# EAGLE board power-board (EAGLE 6.6.0), part 1 of 3
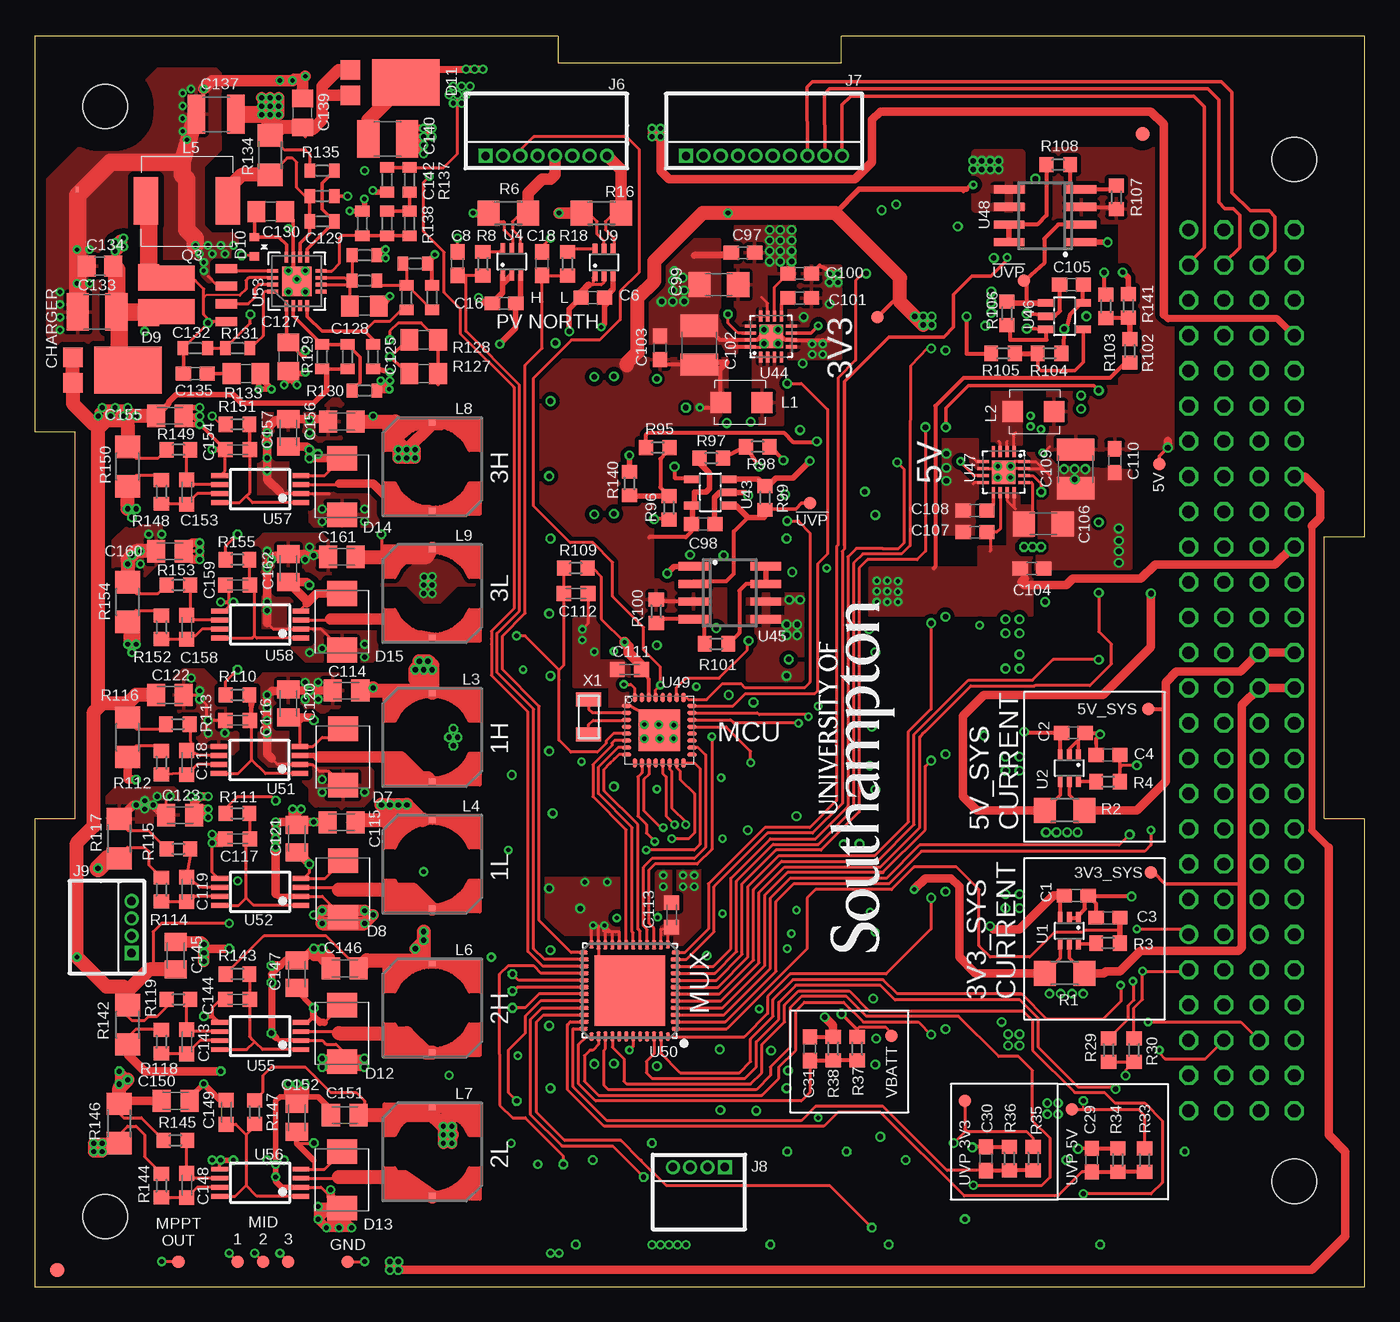
[diagram p18: board, top side]
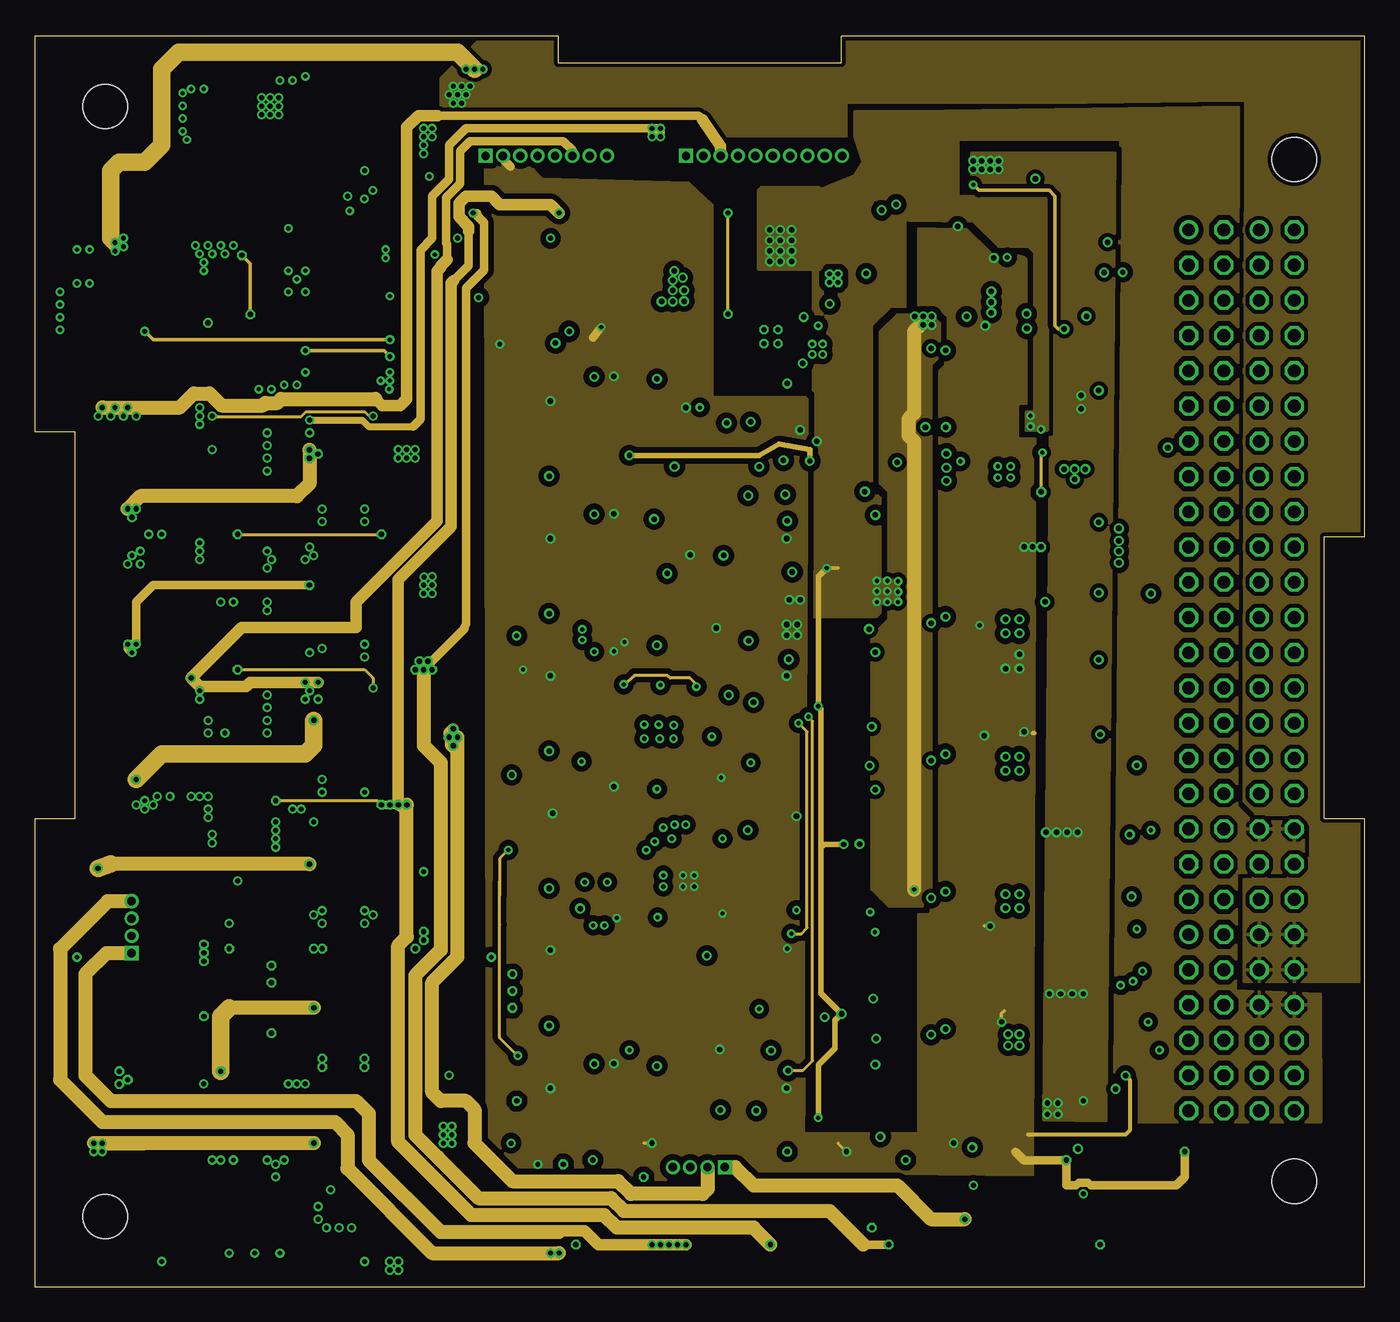
[diagram p19: board, inner layer Route2]
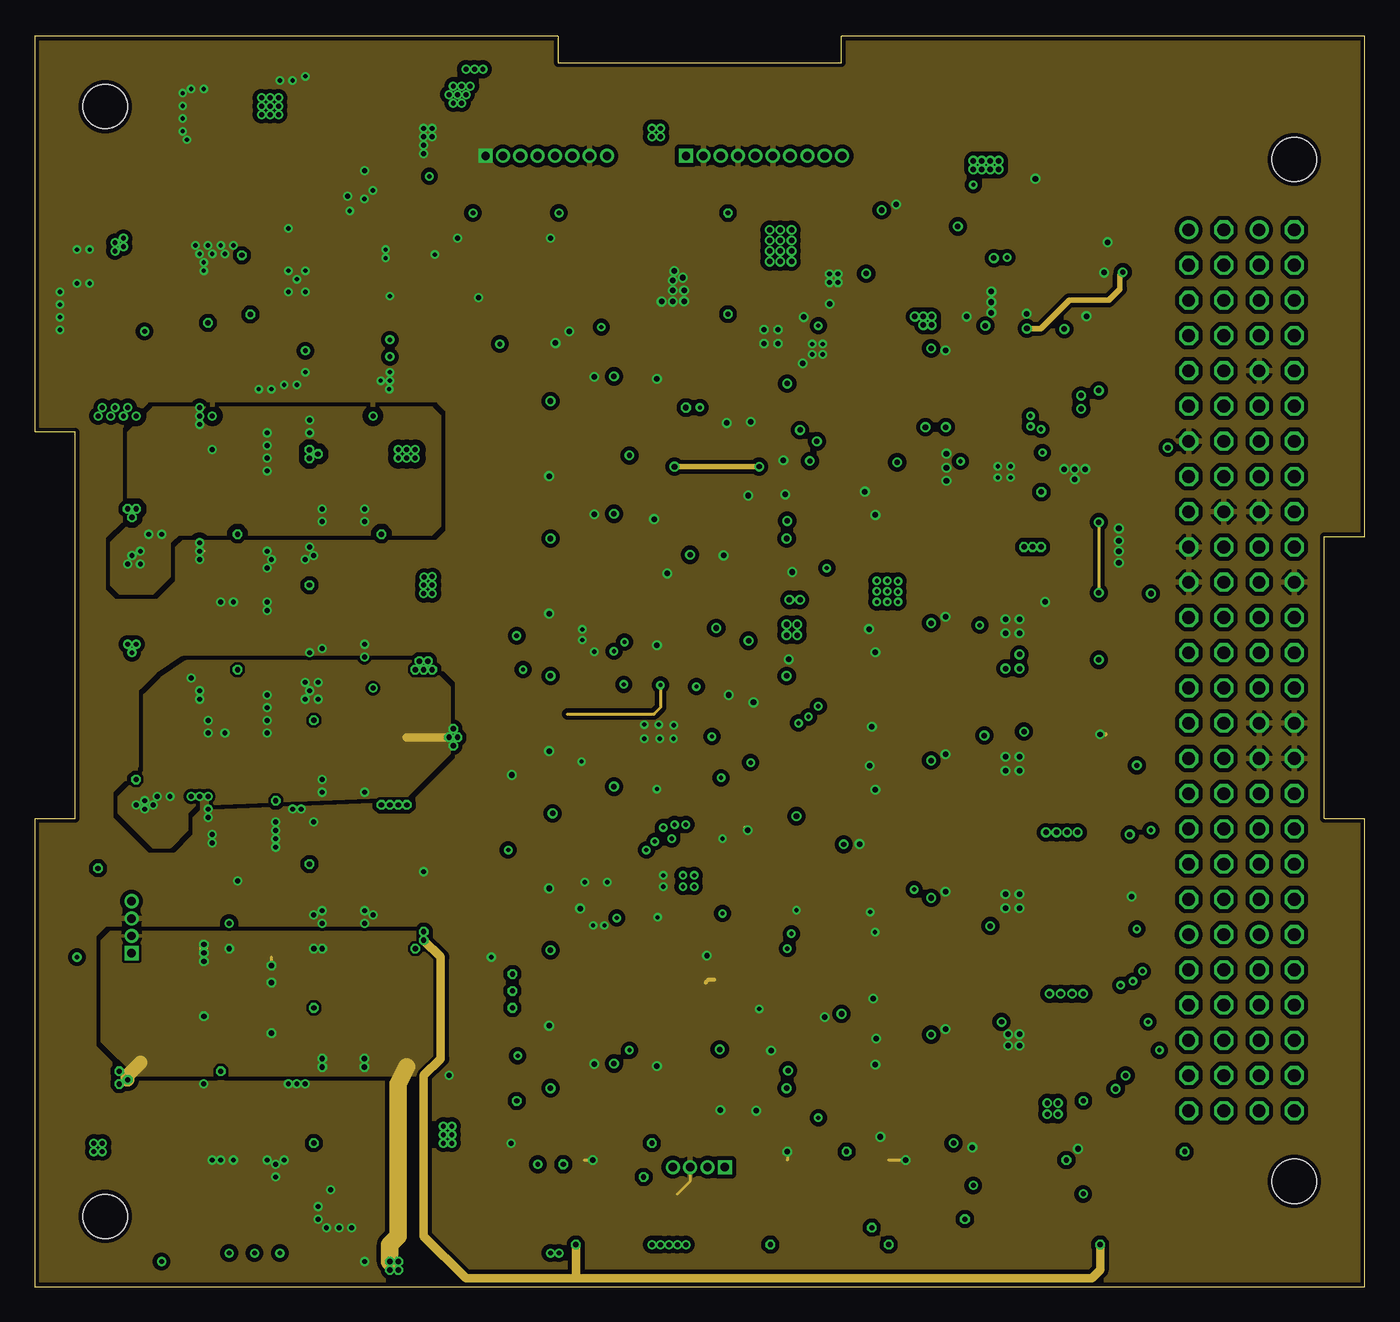
[diagram p20: board, inner layer Route15]
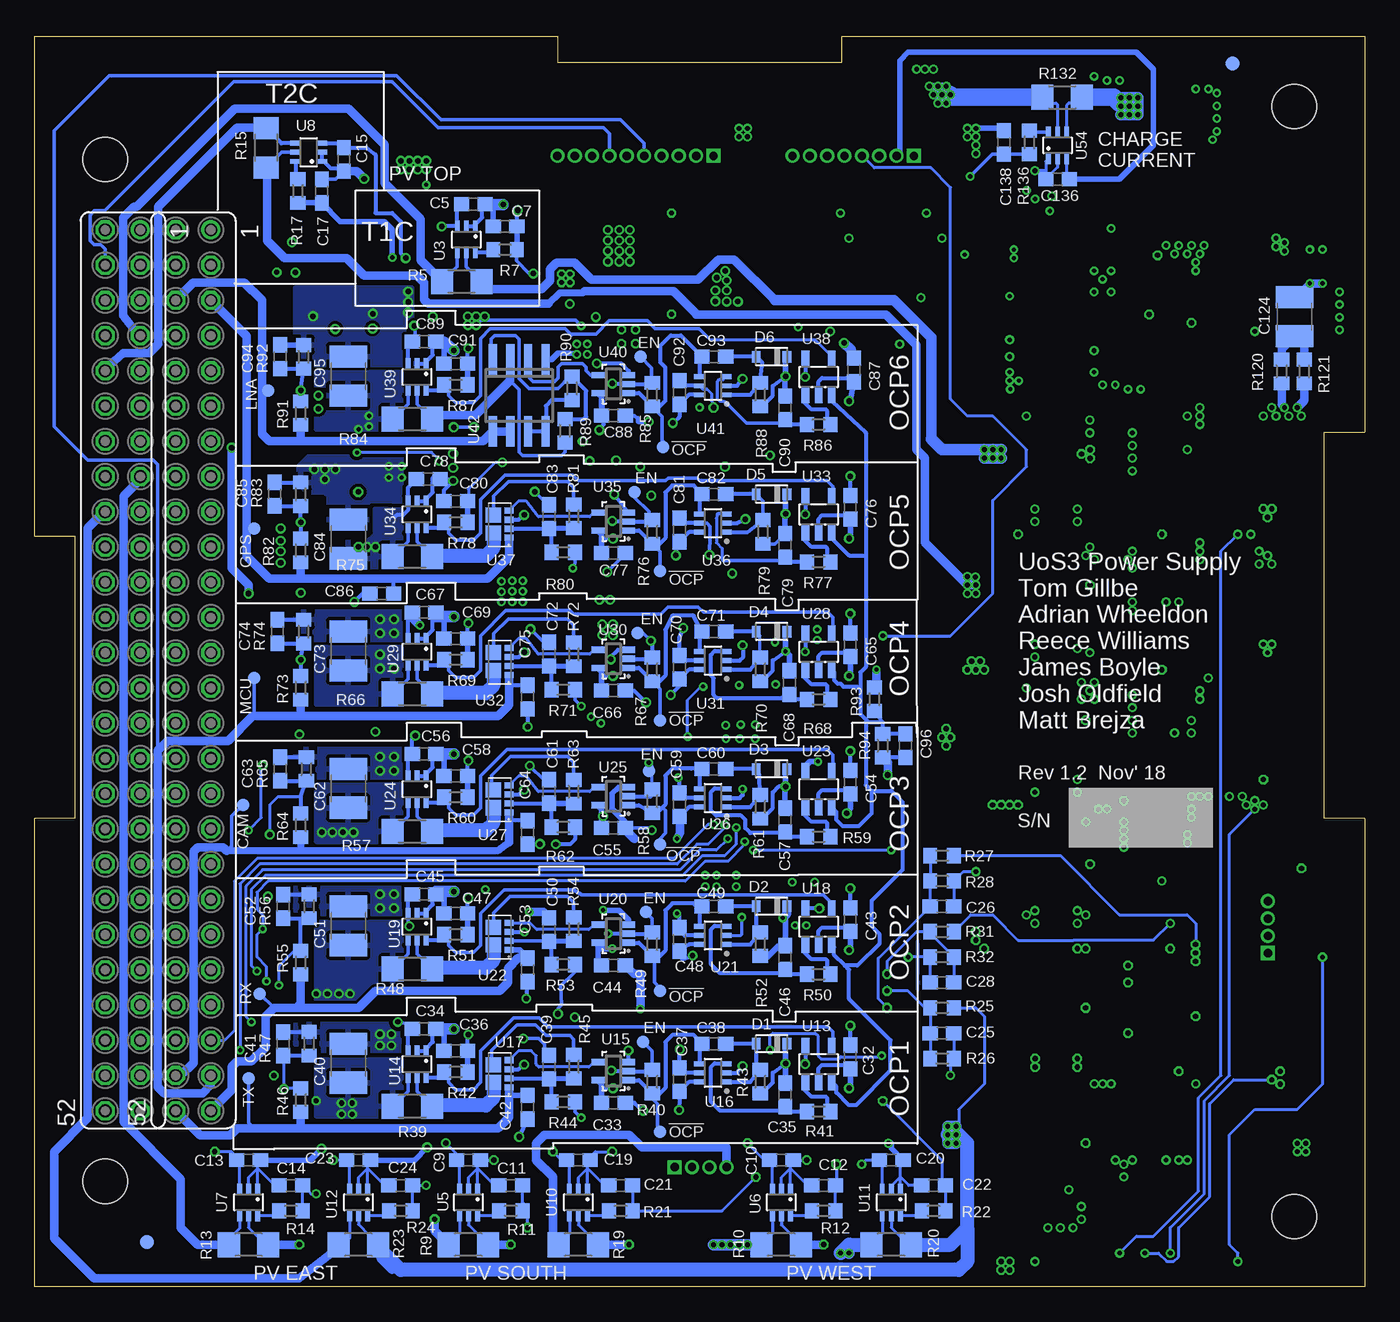
[diagram p21: board, bottom side, seen from below]

Size 95.89 x 90.17 mm. Coordinates in mm from the lower left corner, seen from the top.
Outline: 0,0 95.89,0 95.89,33.78 92.96,33.78 92.96,54.1 95.89,54.1 95.89,90.17 58.17,90.17 58.17,88.27 37.72,88.27 37.72,90.17 0,90.17 0,61.62 2.92,61.62 2.92,33.78 0,33.78 0,0
Copper layers (1*2*15*16): Top 0.035mm / dielectric 0.2mm / Route2 0.035mm / dielectric 1.1mm / Route15 0.035mm / dielectric 0.2mm / Bottom 0.035mm
Design rules "pcbtrain2 *": minimum track width 0.125mm, minimum drill 0.3mm, track to track 8mil, track to pad 6mil, pad to pad 6mil, via to via 7mil, smd to smd 0mil, copper to edge 10mil, drill to drill 0.2mm, minimum pad ring 6mil, minimum via ring 6mil, stop-mask expansion 0.125mm, vias tented up to drill 16mil, thermal gap 10mil
Holes 3.2 mm at 5.08,5.08 5.08,85.09 90.81,7.62 90.81,81.28

## Footprints (pad centres in the part's own frame; a part is rotated, then mirrored left to right if it is on the bottom)
C0603 = smd 1.1 x 1: 1 -0.85,0; 2 0.85,0
C1210 = smd 1.6 x 2.7: 1 -1.4,0; 2 1.4,0
C1206 = smd 1.6 x 1.8: 1 -1.4,0; 2 1.4,0
C0603K = smd 1.05 x 1.08: 1 -0.875,0; 2 0.875,0
C0805K = smd 1.3 x 1.6: 1 -1,0; 2 1,0
P0603 = smd 0.762 x 1.016: 1 -0.889,0; 2 0.889,0
P0805 = smd 1.27 x 1.524: 1 -1.041,0; 2 1.041,0
C0805 = smd 1.3 x 1.5: 1 -0.95,0; 2 0.95,0
P1210 = smd 1.27 x 2.794: 1 -1.422,0; 2 1.422,0
SOD-323 = smd 0.63 x 0.83: 1 -1.113,0; 2 1.113,0
SMBJ = smd 1.78 x 2.16: A 2.04,0; C -2.03,0
POWERDI5 = smd 3.36 x 4.86: HEAT_SINK 0,3.282 | smd 1.39 x 1.4: LEFT -0.92,-0.7; RIGHT 0.92,-0.7
SOD-523 = smd 0.6 x 0.7: 1 -0.7,0; 2 0.7,0
FIDUCIAL-1X2-STOP = smd 1 x 1: 1 0,0
FE26-2 = drill 0.914: 1 -30.48,1.27; 41 20.32,1.27 | drill 0.914 octagon: 2 -30.48,-1.27; 3 -27.94,1.27; 4 -27.94,-1.27; 5 -25.4,1.27; 6 -25.4,-1.27; 7 -22.86,1.27; 8 -22.86,-1.27; 9 -20.32,1.27; 10 -20.32,-1.27; 11 -17.78,1.27; 12 -17.78,-1.27; 13 -15.24,1.27; 14 -15.24,-1.27; 15 -12.7,1.27; 16 -12.7,-1.27; 17 -10.16,1.27; 18 -10.16,-1.27; 19 -7.62,1.27; 20 -7.62,-1.27; 21 -5.08,1.27; 22 -5.08,-1.27; 23 -2.54,1.27; 24 -2.54,-1.27; 25 0,1.27; 26 0,-1.27; 27 2.54,1.27; 28 2.54,-1.27; 29 5.08,1.27; 30 5.08,-1.27; 31 7.62,1.27; 32 7.62,-1.27; 33 10.16,1.27; 34 10.16,-1.27; 35 12.7,1.27; 36 12.7,-1.27; 37 15.24,1.27; 38 15.24,-1.27; 39 17.78,1.27; 40 17.78,-1.27; 42 20.32,-1.27; 43 22.86,1.27; 44 22.86,-1.27; 45 25.4,1.27; 46 25.4,-1.27; 47 27.94,1.27; 48 27.94,-1.27; 49 30.48,1.27; 50 30.48,-1.27; 51 33.02,1.27; 52 33.02,-1.27
DF13-8P-1.25DS = drill 0.6 pad 1.016 square: P$1 4.375,0 | drill 0.6 pad 1.016: P$2 3.125,0; P$3 1.875,0; P$4 0.625,0; P$5 -0.625,0; P$6 -1.875,0; P$7 -3.125,0; P$8 -4.375,0
DF13-10P-1.25DS = drill 0.6 pad 1.016 square: P$1 5.625,0 | drill 0.6 pad 1.016: P$2 4.375,0; P$3 3.125,0; P$4 1.875,0; P$5 0.625,0; P$6 -0.625,0; P$7 -1.875,0; P$8 -3.125,0; P$9 -4.375,0; P$10 -5.625,0
DF13-4P-1.25DS = drill 0.6 pad 1.016 square: P$1 1.875,0 | drill 0.6 pad 1.016: P$2 0.625,0; P$3 -0.625,0; P$4 -1.875,0
VISHAY-INDUCTOR = smd 1.5 x 1.499: 1 -1.508,0; 2 1.476,0
MSS7341 = smd 0.5 x 0.5: 1 0,3.225; 2 0,-3.225
IHLP2525CZ = smd 1.778 x 3.429: 1 -2.946,0; 2 2.946,0
SO8-POWERPAK_DUAL = smd 0.66 x 1.524: 1 -1.905,-2.794; 2 -0.635,-2.794; 3 0.635,-2.794; 4 1.905,-2.794; 5 1.905,2.794; 8 -1.905,2.794 | smd 1.803 x 4.064: PAD56 1.206,1.524; PAD78 -1.206,1.524
R1206 = smd 1.6 x 1.803: 1 -1.422,0; 2 1.422,0
R0603 = smd 1 x 1.1: 1 -0.85,0; 2 0.85,0
SHORT = smd 0.203 x 0.203: 1 -0.076,0; 2 0.076,0
TP09R = smd 0.9 x 0.9: TP 0,0
SC70-6 = smd 0.35 x 0.8: 1 -0.65,-0.95; 2 0,-0.95; 3 0.65,-0.95; 4 0.65,0.95; 5 0,0.95; 6 -0.65,0.95
SOT23-5 = smd 0.55 x 1.2: 1 -0.95,-1.3; 2 0,-1.3; 3 0.95,-1.3; 4 0.95,1.3; 5 -0.95,1.3
SC70-5 = smd 0.45 x 0.95: 1 -0.65,-1.1; 2 0,-1.1; 3 0.65,-1.1; 4 0.65,1.1; 5 -0.65,1.1
CHIPFET-1206A-S2 = smd 0.457 x 0.66: 1 -0.975,-0.68; 2 -0.328,-0.68; 3 0.32,-0.68; 4 0.973,-0.68 | smd 0.55 x 1.12: 5 0.91,0.45; 6 0.37,0.45; 7 -0.367,0.45; 8 -0.9,0.45
SO8 = smd 0.6 x 2.2: 1 -1.905,-2.6; 2 -0.635,-2.6; 3 0.635,-2.6; 4 1.905,-2.6; 5 1.905,2.6; 6 0.635,2.6; 7 -0.635,2.6; 8 -1.905,2.6
RGT.16 = smd 0.8 x 0.23: 1 -1.475,0.75; 2 -1.475,0.25; 3 -1.475,-0.25; 4 -1.475,-0.75; 9 1.475,-0.75; 10 1.475,-0.25; 11 1.475,0.25; 12 1.475,0.75 | smd 0.23 x 0.8: 5 -0.75,-1.475; 6 -0.25,-1.475; 7 0.25,-1.475; 8 0.75,-1.475; 13 0.75,1.475; 14 0.25,1.475; 15 -0.25,1.475; 16 -0.75,1.475 | smd 1.7 x 1.7: PAD 0,0
RHB32 = smd 0.7 x 0.3: 1 -2.35,1.75; 2 -2.35,1.25; 3 -2.35,0.75; 4 -2.35,0.25; 5 -2.35,-0.25; 6 -2.35,-0.75; 7 -2.35,-1.25; 8 -2.35,-1.75; 17 2.35,-1.75; 18 2.35,-1.25; 19 2.35,-0.75; 20 2.35,-0.25; 21 2.35,0.25; 22 2.35,0.75; 23 2.35,1.25; 24 2.35,1.75 | smd 0.3 x 0.7: 9 -1.75,-2.35; 10 -1.25,-2.35; 11 -0.75,-2.35; 12 -0.25,-2.35; 13 0.25,-2.35; 14 0.75,-2.35; 15 1.25,-2.35; 16 1.75,-2.35; 25 1.75,2.35; 26 1.25,2.35; 27 0.75,2.35; 28 0.25,2.35; 29 -0.25,2.35; 30 -0.75,2.35; 31 -1.25,2.35; 32 -1.75,2.35 | smd 3 x 3: TP 0,0
LFCSP48 = smd 0.6 x 0.3: 1 -3.325,2.75; 12 -3.325,-2.75; 25 3.325,-2.75; 36 3.325,2.75 | smd 0.7 x 0.3: 2 -3.3,2.25; 3 -3.3,1.75; 4 -3.3,1.25; 5 -3.3,0.75; 6 -3.3,0.25; 7 -3.3,-0.25; 8 -3.3,-0.75; 9 -3.3,-1.25; 10 -3.3,-1.75; 11 -3.3,-2.25; 26 3.3,-2.25; 27 3.3,-1.75; 28 3.3,-1.25; 29 3.3,-0.75; 30 3.3,-0.25; 31 3.3,0.25; 32 3.3,0.75; 33 3.3,1.25; 34 3.3,1.75; 35 3.3,2.25 | smd 0.3 x 0.6: 13 -2.75,-3.325; 24 2.75,-3.325; 37 2.75,3.325; 48 -2.75,3.325 | smd 0.3 x 0.7: 14 -2.25,-3.3; 15 -1.75,-3.3; 16 -1.25,-3.3; 17 -0.75,-3.3; 18 -0.25,-3.3; 19 0.25,-3.3; 20 0.75,-3.3; 21 1.25,-3.3; 22 1.75,-3.3; 23 2.25,-3.3; 38 2.25,3.3; 39 1.75,3.3; 40 1.25,3.3; 41 0.75,3.3; 42 0.25,3.3; 43 -0.25,3.3; 44 -0.75,3.3; 45 -1.25,3.3; 46 -1.75,3.3; 47 -2.25,3.3 | smd 5.1 x 5.1: EXP 0,0
TSSOP8 = smd 1.2 x 0.35: 1 -2.925,0.975; 2 -2.925,0.325; 3 -2.925,-0.325; 4 -2.925,-0.975; 5 2.925,-0.975; 6 2.925,-0.325; 7 2.925,0.325; 8 2.925,0.975
RVA16_2P14X2P14 = smd 0.787 x 0.279: 1 -1.75,0.75; 2 -1.75,0.25; 3 -1.75,-0.25; 4 -1.75,-0.75; 9 1.75,-0.75; 10 1.75,-0.25; 11 1.75,0.25; 12 1.75,0.75 | smd 0.279 x 0.787: 5 -0.75,-1.75; 6 -0.25,-1.75; 7 0.25,-1.75; 8 0.75,-1.75; 13 0.75,1.75; 14 0.25,1.75; 15 -0.25,1.75; 16 -0.75,1.75 | smd 2.134 x 2.134: 17 0,0
CC7V-T1A = smd 1.8 x 1: P$1 0,1.25; P$2 0,-1.25

## Placement (x,y rotation side)
C1  100n  [C0603]  75.08,28.21 0 top
C2  100n  [C0603]  74.88,39.94 0 top
C3  1u  [C0603]  77.37,26.62 180 top
C4  1u  [C0603]  77.37,38.35 180 top
C5  100n  [C0603]  64.26,78.04 0 bottom
C6  100n  [C0603]  40.23,71.32 180 top
C7  1u  [C0603]  61.98,76.45 180 bottom
C8  1u  [C0603]  30.48,73.76 90 top
C9  100n  [C0603]  64.62,9.14 0 bottom
C10  100n  [C0603]  42.06,9.14 0 bottom
C11  1u  [C0603]  61.57,7.32 180 bottom
C12  1u  [C0603]  39.01,7.32 180 bottom
C13  100n  [C0603]  80.47,9.14 0 bottom
C14  1u  [C0603]  77.42,7.32 180 bottom
C15  100n  [C0603]  73.6,81.28 270 bottom
C16  100n  [C0603]  33.83,70.9 180 top
C17  1u  [C0603]  75.18,78.99 90 bottom
C18  1u  [C0603]  36.58,73.76 90 top
C19  100n  [C0603]  56.69,9.14 0 bottom
C20  100n  [C0603]  34.14,9.14 0 bottom
C21  1u  [C0603]  53.64,7.32 180 bottom
C22  1u  [C0603]  31.09,7.32 180 bottom
C23  100n  [C0603]  72.54,9.14 0 bottom
C24  1u  [C0603]  69.49,7.32 180 bottom
C25  1u  [C0603]  30.48,18.29 0 bottom
C26  1u  [C0603]  30.48,27.43 0 bottom
C28  1u  [C0603]  30.48,21.95 180 bottom
C29  1u  [C0603]  76.2,9.14 90 top
C30  1u  [C0603]  68.58,9.25 90 top
C31  1u  [C0603]  55.88,17.17 90 top
C32  100n  [C0603]  37.08,16.57 90 bottom
C33  100n  [C0603]  54.17,13.27 0 bottom
C34  100n  [C0603]  67.82,18.61 0 bottom
C35  1n  [C0603]  41.78,13.84 90 bottom
C36  1u  [C0603]  65.53,17.02 180 bottom
C37  100n  [C0603]  49.4,14.95 270 bottom
C38  1u  [C0603]  46.93,17.53 180 bottom
C39  1n  [C0603]  58.8,15.85 90 bottom
C40  22u  [C1210]  73.28,16.13 90 bottom
C41  100n  [C0603]  77.98,17.53 90 bottom
C42  510p  [C0603]  60.35,12.95 270 bottom
C43  100n  [C0603]  37.08,26.48 90 bottom
C44  100n  [C0603]  54.17,23.18 0 bottom
C45  100n  [C0603]  67.82,28.31 0 bottom
C46  1n  [C0603]  41.78,23.75 90 bottom
C47  1u  [C0603]  65.53,26.92 180 bottom
C48  100n  [C0603]  49.4,25.06 270 bottom
C49  1u  [C0603]  46.93,27.43 180 bottom
C50  1n  [C0603]  58.8,25.76 90 bottom
C51  22u  [C1210]  73.28,26.04 90 bottom
C52  100n  [C0603]  77.98,27.43 90 bottom
C53  510p  [C0603]  60.35,22.86 270 bottom
C54  100n  [C0603]  37.08,36.39 90 bottom
C55  100n  [C0603]  54.17,33.08 0 bottom
C56  100n  [C0603]  67.82,38.42 0 bottom
C57  1n  [C0603]  41.78,33.66 90 bottom
C58  1u  [C0603]  65.53,36.83 180 bottom
C59  100n  [C0603]  49.4,34.76 270 bottom
C60  1u  [C0603]  46.93,37.34 180 bottom
C61  1n  [C0603]  58.8,35.71 90 bottom
C62  22u  [C1210]  73.28,35.94 90 bottom
C63  100n  [C0603]  78.18,37.34 90 bottom
C64  510p  [C0603]  60.35,32.77 270 bottom
C65  100n  [C0603]  37.08,46.29 90 bottom
C66  100n  [C0603]  54.17,42.99 0 bottom
C67  100n  [C0603]  67.82,48.63 0 bottom
C68  1n  [C0603]  41.48,43.56 90 bottom
C69  1u  [C0603]  65.53,46.74 180 bottom
C70  100n  [C0603]  49.4,44.67 270 bottom
C71  1u  [C0603]  46.93,47.24 180 bottom
C72  1n  [C0603]  58.8,45.62 90 bottom
C73  22u  [C1210]  73.28,45.85 90 bottom
C74  100n  [C0603]  78.38,47.24 90 bottom
C75  510p  [C0603]  60.35,42.52 270 bottom
C76  100n  [C0603]  37.08,56.2 90 bottom
C77  100n  [C0603]  54.17,52.9 0 bottom
C78  100n  [C0603]  67.51,58.23 0 bottom
C79  470n  [C0603]  41.78,53.47 90 bottom
C80  1u  [C0603]  65.53,56.64 180 bottom
C81  100n  [C0603]  49.4,54.57 270 bottom
C82  1u  [C0603]  46.93,57.15 180 bottom
C83  1n  [C0603]  58.8,55.52 90 bottom
C84  22u  [C1210]  73.28,53.92 90 bottom
C85  100n  [C0603]  78.59,57.15 90 bottom
C86  510p  [C0603]  70.87,49.99 180 bottom
C87  100n  [C0603]  36.83,66.1 90 bottom
C88  100n  [C0603]  54.17,62.8 0 bottom
C89  100n  [C0603]  67.82,68.14 0 bottom
C90  1n  [C0603]  41.78,63.37 90 bottom
C91  1u  [C0603]  65.53,66.55 180 bottom
C92  100n  [C0603]  49.4,64.48 270 bottom
C93  1u  [C0603]  46.93,67.06 180 bottom
C94  100n  [C0603]  78.18,67.06 90 bottom
C95  22u  [C1210]  73.28,65.66 90 bottom
C96  1u  [C0603]  33.12,39.01 270 bottom
C97  10n  [C0603]  51.05,74.55 180 top
C98  100n  [C0603]  48.2,54.99 0 top
C99  10u  [C1206]  49.31,72.25 180 top
C100  0.1u  [C0603]  55.15,73.05 0 top
C101  3.3n  [C0603]  55.15,71.29 180 top
C102  22u  [C1210]  47.89,67.88 90 top
C103  10n  [C0603]  45.09,67.69 90 top
C104  10n  [C0603]  71.88,51.79 0 top
C105  100n  [C0603]  74.74,72.26 180 top
C106  10u  [C1206]  72.71,55.01 0 top
C107  0.1u  [C0603]  67.79,54.41 180 top
C108  3.3n  [C0603]  67.79,55.96 0 top
C109  22u  [C1210]  75.04,58.97 270 top
C110  10n  [C0603]  77.85,59.56 270 top
C111  0.1u  [C0603K]  42.87,44.51 180 top
C112  1n  [C0603K]  39.01,49.99 0 top
C113  0.1u  [C0603K]  45.92,26.82 90 top
C114  10u  [C0805K]  22.48,42.99 180 top
C115  10u  [C0805K]  22.12,33.49 180 top
C116  100n  [C0603K]  14.63,40.84 180 top
C117  100n  [C0603K]  14.63,32.31 180 top
C118  1u  [C0603K]  10.97,37.8 90 top
C119  1u  [C0603K]  10.97,28.65 90 top
C120  4.7u  [C0805K]  18.29,42.06 90 top
C121  4.7u  [C0805K]  18.9,32.31 90 top
C122  10u  [C0805K]  9.75,42.67 0 top
C123  10u  [C0805K]  10.49,34.01 0 top
C124  2.2u  [C1210]  5.08,69.95 90 bottom
C125  [P0603]  24.38,67.06 270 top
C126  1.0u  [P0805]  23.77,70.71 0 top
C127  1.0u  [P0805]  18.29,67.06 90 top
C128  22p  [P0603]  22.56,67.06 90 top
C129  0.1u  [P0603]  20.73,76.81 0 top
C130  1.0u  [P0805]  17.02,77.52 0 top
C131  100n  [P0603]  20.73,78.64 0 top
C132  0.1u  [P0603]  11.58,67.67 180 top
C133  10u  [C1210]  4.5,70.28 180 top
C134  1.0u  [C0805]  4.7,73.58 180 top
C135  [C0603]  11.58,65.84 0 top
C136  100n  [C0603]  22.15,79.86 180 bottom
C137  10u  [P1210]  13.08,84.53 180 top
C138  1u  [C0603]  26.01,82.5 90 bottom
C139  1.0u  [P0805]  19.3,84.63 90 top
C140  10u  [C1210]  25.45,82.75 0 top
C141  22p  [P0603]  25.4,76.66 270 top
C142  0.1u  [P0603]  25.4,79.81 270 top
C143  1u  [C0603K]  10.97,17.68 90 top
C144  100n  [C0603K]  14.63,20.73 180 top
C145  10u  [C0805K]  10.16,23.88 90 top
C146  10u  [C0805K]  22.35,22.96 180 top
C147  4.7u  [C0805K]  18.9,22.56 90 top
C148  1u  [C0603K]  10.97,7.32 90 top
C149  100n  [C0603K]  13.82,12.6 90 top
C150  10u  [C0805K]  10.16,13.41 0 top
C151  10u  [C0805K]  22.35,12.4 180 top
C152  4.7u  [C0805K]  18.9,12.19 90 top
C153  1u  [C0603K]  10.97,57.3 90 top
C154  100n  [C0603K]  14.63,60.35 180 top
C155  10u  [C0805K]  9.75,62.79 0 top
C156  10u  [C0805K]  22.15,62.38 180 top
C157  4.7u  [C0805K]  18.29,61.57 90 top
C158  1u  [C0603K]  10.97,47.55 90 top
C159  100n  [C0603K]  14.63,50.6 180 top
C160  10u  [C0805K]  9.75,53.04 0 top
C161  10u  [C0805K]  22.15,52.63 180 top
C162  4.7u  [C0805K]  18.29,51.82 90 top
D1  PMEG2005AEA  [SOD-323]  42.76,17.53 180 bottom
D2  PMEG2005AEA  [SOD-323]  42.76,27.43 180 bottom
D3  PMEG2005AEA  [SOD-323]  42.76,37.34 180 bottom
D4  PMEG2005AEA  [SOD-323]  42.76,47.24 180 bottom
D5  PMEG2005AEA  [SOD-323]  42.76,57.15 180 bottom
D6  PMEG2005AEA  [SOD-323]  42.76,67.06 180 bottom
D7  5V1  [SMBJ]  22.23,38.2 270 top
D8  5V1  [SMBJ]  22.23,28.7 270 top
D9  PDS1040  [POWERDI5]  3.45,66.09 270 top
D10  ZLLS350  [SOD-523]  15.85,74.98 90 top
D11  PDS1040  [POWERDI5]  23.47,86.82 270 top
D12  5V1  [SMBJ]  22.15,18.29 270 top
D13  5V1  [SMBJ]  22.15,7.72 270 top
D14  5V1  [SMBJ]  22.15,57.71 270 top
D15  5V1  [SMBJ]  22.15,47.96 270 top
FID1  FIDUCIAL1X2-STOP  [FIDUCIAL-1X2-STOP]  1.63,1.22 0 top
FID2  FIDUCIAL1X2-STOP  [FIDUCIAL-1X2-STOP]  79.86,83.11 0 top
FID3  FIDUCIAL1X2-STOP  [FIDUCIAL-1X2-STOP]  9.55,88.19 0 bottom
FID4  FIDUCIAL1X2-STOP  [FIDUCIAL-1X2-STOP]  87.78,3.25 0 bottom
J1  H1  [FE26-2]  84.45,45.72 270 bottom
J2  H2  [FE26-2]  89.53,45.72 270 bottom
J6  DF13-8P-1.25DS  [DF13-8P-1.25DS]  36.88,81.53 180 top
J7  DF13-10P-1.25DS  [DF13-10P-1.25DS]  52.58,81.53 180 top
J8  DF13-4P-1.25DS  [DF13-4P-1.25DS]  47.88,8.64 0 top
J9  DF13-4P-1.25DS  [DF13-4P-1.25DS]  6.99,25.93 270 top
L1  2.2u  [VISHAY-INDUCTOR]  50.93,63.75 180 top
L2  2.2u  [VISHAY-INDUCTOR]  72.01,63.09 0 top
L3  10uH  [MSS7341]  28.65,39.62 0 top
L4  10uH  [MSS7341]  28.65,30.48 0 top
L5  IHLP2525CZ  [IHLP2525CZ]  10.97,78.28 0 top
L6  10uH  [MSS7341]  28.65,20.12 0 top
L7  10uH  [MSS7341]  28.65,9.75 0 top
L8  10uH  [MSS7341]  28.65,59.13 0 top
L9  10uH  [MSS7341]  28.65,49.99 0 top
Q3  SI7288  [SO8-POWERPAK_DUAL]  11.02,71.5 90 top
R1  250m  [R1206]  74.25,22.62 0 top
R2  124m  [R1206]  74.25,34.35 0 top
R3  10k  [R0603]  77.37,24.79 180 top
R4  10k  [R0603]  77.37,36.42 180 top
R5  43m  [R1206]  65.09,72.45 0 bottom
R6  43m  [R1206]  34.14,77.42 180 top
R7  10k  [R0603]  61.98,74.78 180 bottom
R8  10k  [R0603]  32.31,73.76 90 top
R9  43m  [R1206]  64.62,3.05 0 bottom
R10  43m  [R1206]  42.06,3.05 0 bottom
R11  10k  [R0603]  61.57,5.49 180 bottom
R12  10k  [R0603]  39.01,5.49 180 bottom
R13  43m  [R1206]  80.47,3.05 0 bottom
R14  10k  [R0603]  77.42,5.49 180 bottom
R15  43m  [R1206]  79.18,82.11 270 bottom
R16  43m  [R1206]  40.84,77.42 180 top
R17  10k  [R0603]  76.91,78.99 90 bottom
R18  10k  [R0603]  38.4,73.76 90 top
R19  43m  [R1206]  56.69,3.05 0 bottom
R20  43m  [R1206]  34.14,3.05 0 bottom
R21  10k  [R0603]  53.64,5.49 180 bottom
R22  10k  [R0603]  31.09,5.49 180 bottom
R23  43m  [R1206]  72.54,3.05 0 bottom
R24  10k  [R0603]  69.49,5.49 180 bottom
R25  309k  [R0603]  30.48,20.12 0 bottom
R26  100k  [R0603]  30.48,16.46 180 bottom
R27  309k  [R0603]  30.48,31.09 0 bottom
R28  100k  [R0603]  30.48,29.26 180 bottom
R29  4k7  [R0603]  77.42,17.07 270 top
R30  4k7  [R0603]  79.25,17.07 270 top
R31  309k  [R0603]  30.48,25.6 0 bottom
R32  100k  [R0603]  30.48,23.77 0 bottom
R33  309k  [R0603]  80.01,9.14 90 top
R34  100k  [R0603]  78.08,9.14 270 top
R35  309k  [R0603]  71.98,9.25 90 top
R36  100k  [R0603]  70.26,9.25 270 top
R37  309k  [R0603]  59.28,17.17 90 top
R38  100k  [R0603]  57.56,17.17 270 top
R39  50m  [R1206]  68.65,13.02 0 bottom
R40  100k  [R0603]  51.37,14.8 270 bottom
R41  1k  [R0603]  39.37,12.64 180 bottom
R42  10k  [R0603]  65.53,15.49 180 bottom
R43  499k  [R0603]  43.59,14.8 270 bottom
R44  100k  [R0603]  57.78,13.34 0 bottom
R45  0  [R0603]  57.02,15.88 270 bottom
R46  309k  [R0603]  76.71,13.46 270 bottom
R47  100k  [R0603]  76.1,17.53 270 bottom
R48  124m  [R1206]  68.65,22.92 0 bottom
R49  100k  [R0603]  51.37,24.7 270 bottom
R50  1k  [R0603]  39.37,22.54 180 bottom
R51  10k  [R0603]  65.53,25.4 180 bottom
R52  499k  [R0603]  43.59,24.7 270 bottom
R53  100k  [R0603]  57.78,23.24 0 bottom
R54  0  [R0603]  57.02,25.78 270 bottom
R55  309k  [R0603]  76.71,23.37 270 bottom
R56  100k  [R0603]  76.1,27.43 270 bottom
R57  124m  [R1206]  68.65,32.83 0 bottom
R58  100k  [R0603]  51.37,35.01 270 bottom
R59  1k  [R0603]  39.37,32.45 180 bottom
R60  10k  [R0603]  65.53,35.31 180 bottom
R61  499k  [R0603]  43.59,34.61 270 bottom
R62  100k  [R0603]  57.78,33.15 0 bottom
R63  0  [R0603]  57.02,35.69 270 bottom
R64  309k  [R0603]  76.71,33.27 270 bottom
R65  100k  [R0603]  76.3,37.34 270 bottom
R66  442m  [R1206]  68.65,42.74 0 bottom
R67  100k  [R0603]  51.37,44.51 270 bottom
R68  1k  [R0603]  39.37,42.35 180 bottom
R69  10k  [R0603]  65.53,45.21 180 bottom
R70  499k  [R0603]  43.59,44.51 270 bottom
R71  100k  [R0603]  57.78,43.05 0 bottom
R72  0  [R0603]  57.02,45.59 270 bottom
R73  309k  [R0603]  76.71,43.18 270 bottom
R74  100k  [R0603]  76.5,47.24 270 bottom
R75  50m  [R1206]  68.65,52.64 0 bottom
R76  100k  [R0603]  51.37,54.42 270 bottom
R77  1k  [R0603]  39.37,52.26 180 bottom
R78  10k  [R0603]  65.53,55.12 180 bottom
R79  499k  [R0603]  43.38,54.42 270 bottom
R80  100k  [R0603]  57.78,52.96 0 bottom
R81  0  [R0603]  57.02,55.55 270 bottom
R82  309k  [R0603]  76.71,53.09 270 bottom
R83  100k  [R0603]  76.71,57.15 270 bottom
R84  124m  [R1206]  68.65,62.55 0 bottom
R85  100k  [R0603]  51.37,64.33 270 bottom
R86  1k  [R0603]  39.37,62.17 180 bottom
R87  10k  [R0603]  65.53,65.02 180 bottom
R88  499k  [R0603]  43.59,64.33 270 bottom
R89  499  [R0603]  57.66,61.72 90 bottom
R90  0  [R0603]  57.15,64.77 90 bottom
R91  309k  [R0603]  76.71,62.99 270 bottom
R92  100k  [R0603]  76.5,67.06 270 bottom
R93  22.6k  [R0603]  35.36,42.37 90 bottom
R94  75k  [R0603]  34.75,39.01 90 bottom
R95  20k  [R0603]  44.92,60.5 0 top
R96  10.2k  [R0603]  45.72,56.17 90 top
R97  12.4k  [R0603]  48.77,59.75 180 top
R98  124k  [R0603]  52.12,60.57 180 top
R99  100k  [R0603]  52.64,56.87 270 top
R100  100k  [R0603]  44.81,48.7 270 top
R101  0  [R0603]  49.15,46.35 180 top
R102  20k  [R0603]  78.94,67.48 90 top
R103  10.2k  [R0603]  77.22,70.68 270 top
R104  12.4k  [R0603]  73.15,67.3 0 top
R105  124k  [R0603]  69.8,67.3 0 top
R106  100k  [R0603]  70.09,70.18 90 top
R107  100k  [R0603]  77.98,78.55 90 top
R108  0  [R0603]  73.79,80.9 0 top
R109  47k  [R0603]  39.01,51.82 0 top
R110  1k  [R0603]  14.63,42.67 0 top
R111  1k  [R0603]  14.63,34.14 0 top
R112  1k  [R0603]  9.14,37.8 270 top
R113  1k  [R0603]  10.31,40.56 0 top
R114  1k  [R0603]  9.14,28.65 270 top
R115  1k  [R0603]  10.36,31.57 0 top
R116  10m  [R1206]  6.71,39.62 270 top
R117  10m  [R1206]  6.1,32.31 270 top
R118  1k  [R0603]  9.14,17.68 270 top
R119  1k  [R0603]  10.36,20.73 0 top
R120  3.9  [R0603]  5.99,65.99 270 bottom
R121  3.9  [R0603]  4.37,65.99 270 bottom
R122  10.0k  [P0603]  27.43,73.76 180 top
R123  30.1k  [P0603]  28.65,71.32 270 top
R124  5.23k  [P0603]  23.77,72.54 180 top
R125  100  [P0603]  26.82,71.32 270 top
R126  100k  [P0603]  23.77,74.37 180 top
R127  10  [P0805]  28.04,65.84 0 top
R128  [P0805]  28.04,68.28 0 top
R129  698k  [P0603]  20.73,67.06 270 top
R130  100k  [P0603]  23.77,64.62 180 top
R131  2.2  [P0603]  14.63,67.67 180 top
R132  250m  [R1206]  21.82,85.75 180 bottom
R133  [P0805]  15.24,65.84 180 top
R134  62m  [R1206]  16.97,81.58 90 top
R135  0  [P0603]  20.73,80.47 180 top
R136  10k  [R0603]  24.18,82.5 90 bottom
R137  0  [P0603]  27.03,79.81 90 top
R138  301k  [P0603]  27.03,76.66 90 top
R139  102k  [P0603]  23.62,76.66 270 top
R140  4.02k  [R0603]  42.88,57.91 90 top
R141  4.02k  [R0603]  78.84,70.71 90 top
R142  10m  [R1206]  6.71,18.9 270 top
R143  1k  [R0603]  14.63,22.56 0 top
R144  1k  [R0603]  9.14,7.32 270 top
R145  1k  [R0603]  10.16,10.57 0 top
R146  10m  [R1206]  6.1,11.79 270 top
R147  1k  [R0603]  15.85,12.6 270 top
R148  1k  [R0603]  9.14,57.3 270 top
R149  1k  [R0603]  10.36,60.35 0 top
R150  10m  [R1206]  6.71,59.13 270 top
R151  1k  [R0603]  14.63,62.18 0 top
R152  1k  [R0603]  9.14,47.55 270 top
R153  1k  [R0603]  10.36,50.6 0 top
R154  10m  [R1206]  6.71,49.38 270 top
R155  1k  [R0603]  14.63,52.43 0 top
SH1  SHORT  [SHORT]  19.05,72.87 270 top
SH2  SHORT  [SHORT]  3.07,79.1 270 top
TP1  PTR1TP09R  [TP09R]  52.22,67.06 0 bottom
TP2  PTR1TP09R  [TP09R]  50.6,60.55 0 bottom
TP3  PTR1TP09R  [TP09R]  52.63,57.3 0 bottom
TP4  PTR1TP09R  [TP09R]  50.8,51.61 0 bottom
TP5  PTR1TP09R  [TP09R]  52.43,47.14 0 bottom
TP6  PTR1TP09R  [TP09R]  50.8,40.84 0 bottom
TP7  PTR1TP09R  [TP09R]  51.61,37.19 0 bottom
TP8  PTR1TP09R  [TP09R]  50.8,31.9 0 bottom
TP9  PTR1TP09R  [TP09R]  51.82,27.03 0 bottom
TP10  PTR1TP09R  [TP09R]  50.8,21.34 0 bottom
TP11  PTR1TP09R  [TP09R]  52.02,17.68 0 bottom
TP12  PTR1TP09R  [TP09R]  50.8,11.18 0 bottom
TP13  PTR1TP09R  [TP09R]  55.88,56.49 0 top
TP14  PTR1TP09R  [TP09R]  71.32,72.54 0 top
TP15  PTR1TP09R  [TP09R]  80.26,41.66 0 top
TP16  PTR1TP09R  [TP09R]  80.47,29.87 0 top
TP17  PTR1TP09R  [TP09R]  67.06,13.41 0 top
TP18  PTR1TP09R  [TP09R]  74.78,12.8 0 top
TP19  PTR1TP09R  [TP09R]  61.77,18.08 0 top
TP20  PTR1TP09R  [TP09R]  81.08,59.33 0 top
TP21  PTR1TP09R  [TP09R]  60.76,69.9 0 top
TP22  PTR1TP09R  [TP09R]  79.04,64.62 0 bottom
TP23  PTR1TP09R  [TP09R]  80.06,54.66 0 bottom
TP24  PTR1TP09R  [TP09R]  80.06,43.89 0 bottom
TP25  PTR1TP09R  [TP09R]  80.87,34.75 0 bottom
TP26  PTR1TP09R  [TP09R]  79.65,21.13 0 bottom
TP27  PTR1TP09R  [TP09R]  80.47,15.04 0 bottom
TP29  PTR1TP09R  [TP09R]  14.63,1.83 0 top
TP31  PTR1TP09R  [TP09R]  10.36,1.83 0 top
TP32  PTR1TP09R  [TP09R]  16.46,1.83 0 top
TP33  PTR1TP09R  [TP09R]  22.56,1.83 0 top
TP35  PTR1TP09R  [TP09R]  18.29,1.83 0 top
U1  INA214DCK  [SC70-6]  74.57,25.67 180 top
U2  INA214DCK  [SC70-6]  74.57,37.4 180 top
U3  INA214DCK  [SC70-6]  64.77,75.5 180 bottom
U4  INA214DCK  [SC70-6]  34.39,73.9 0 top
U5  INA214DCK  [SC70-6]  64.62,6.1 180 bottom
U6  INA214DCK  [SC70-6]  42.06,6.1 180 bottom
U7  INA214DCK  [SC70-6]  80.47,6.1 180 bottom
U8  INA214DCK  [SC70-6]  76.14,81.79 90 bottom
U9  INA214DCK  [SC70-6]  41.05,73.85 0 top
U10  INA214DCK  [SC70-6]  56.69,6.1 180 bottom
U11  INA214DCK  [SC70-6]  34.14,6.1 180 bottom
U12  INA214DCK  [SC70-6]  72.54,6.1 180 bottom
U13  MCP6561T-E/LT  [SOT23-5]  39.37,16.07 0 bottom
U14  INA214DCK  [SC70-6]  68.33,16.07 180 bottom
U15  SN74AUP1G00DCK  [SC70-5]  54.17,15.56 90 bottom
U16  SN74LVC1G373DCK  [SC70-6]  46.99,15.43 90 bottom
U17  NTHD4508NT1  [CHIPFET-1206A-S2]  62.36,15.37 90 bottom
U18  MCP6561T-E/LT  [SOT23-5]  39.37,25.97 0 bottom
U19  INA214DCK  [SC70-6]  68.33,25.97 180 bottom
U20  SN74AUP1G00DCK  [SC70-5]  54.17,25.46 90 bottom
U21  SN74LVC1G373DCK  [SC70-6]  46.99,25.34 90 bottom
U22  NTHD4508NT1  [CHIPFET-1206A-S2]  62.36,25.27 90 bottom
U23  MCP6561T-E/LT  [SOT23-5]  39.37,35.88 0 bottom
U24  INA214DCK  [SC70-6]  68.33,35.88 180 bottom
U25  SN74AUP1G00DCK  [SC70-5]  54.17,35.37 90 bottom
U26  SN74LVC1G373DCK  [SC70-6]  46.99,35.24 90 bottom
U27  NTHD4508NT1  [CHIPFET-1206A-S2]  62.36,35.18 90 bottom
U28  MCP6561T-E/LT  [SOT23-5]  39.37,45.78 0 bottom
U29  INA214DCK  [SC70-6]  68.33,45.78 180 bottom
U30  SN74AUP1G00DCK  [SC70-5]  54.17,45.28 90 bottom
U31  SN74LVC1G373DCK  [SC70-6]  46.99,45.15 90 bottom
U32  NTHD4508NT1  [CHIPFET-1206A-S2]  62.36,45.09 90 bottom
U33  MCP6561T-E/LT  [SOT23-5]  39.37,55.69 0 bottom
U34  INA214DCK  [SC70-6]  68.33,55.69 180 bottom
U35  SN74AUP1G00DCK  [SC70-5]  54.17,55.18 90 bottom
U36  SN74LVC1G373DCK  [SC70-6]  46.99,55.05 90 bottom
U37  NTHD4508NT1  [CHIPFET-1206A-S2]  62.36,54.99 90 bottom
U38  MCP6561T-E/LT  [SOT23-5]  39.37,65.6 0 bottom
U39  INA214DCK  [SC70-6]  68.33,65.6 180 bottom
U40  SN74AUP1T08DCK  [SC70-5]  54.17,65.09 90 bottom
U41  SN74LVC1G373DCK  [SC70-6]  46.99,64.96 90 bottom
U42  FDS8858CZ  [SO8]  60.96,64.26 180 bottom
U43  TLV3491AIDBV  [SOT23-5]  48.7,57.28 90 top
U44  TPS62132RGT  [RGT.16]  53.09,68.52 90 top
U45  FDS8858CZ  [SO8]  50.1,50.04 270 top
U46  TLV3491AIDBV  [SOT23-5]  74.23,69.98 270 top
U47  TPS62133RGT  [RGT.16]  69.85,58.74 270 top
U48  FDS8858CZ  [SO8]  72.83,77.22 90 top
U49  MSP430F2132  [RHB32]  45.02,40.13 0 top
U50  ADG732  [LFCSP48]  42.89,21.36 180 top
U51  SPV1040T  [TSSOP8]  16.21,37.99 180 top
U52  SPV1040T  [TSSOP8]  16.26,28.49 180 top
U53  BQ24650_RVA_16  [RVA16_2P14X2P14]  18.9,72.49 90 top
U54  INA214DCK  [SC70-6]  22.15,82.3 0 bottom
U55  SPV1040T  [TSSOP8]  16.26,18.08 180 top
U56  SPV1040T  [TSSOP8]  16.26,7.52 180 top
U57  SPV1040T  [TSSOP8]  16.26,57.51 180 top
U58  SPV1040T  [TSSOP8]  16.26,47.75 180 top
U$1  [UOS_LOGO_SML]  61.98,24.18 90 top
X1  32.768k  [CC7V-T1A]  39.94,41.08 180 top

## Tracks (layer width: path | path; a pad name or v marks a point on that pad's centre or on a via)
3V3_FLIGHT_MCU
  Bottom 0.254: J7.P$5 51.95,82.43 53.65,84.12 66.6,84.12 69.8,87.33 90.53,87.33 94.49,83.36 94.49,62.03 92.05,59.59 87.33,59.59 87.02,59.28 87.02,38 | TP24.TP 80.06,41.15
  Bottom 0.305: C75.1 61.61,43.37 61.67,43.43
  Bottom 0.406: 61.67,43.99 U32.1
  Bottom 0.61: 76.71,41.15 62.48,41.15 61.68,41.95 61.68,43.43 61.67,43.43 61.67,43.99 | R73.2 76.71,41.15 | 76.71,41.15 80.06,41.15 80.16,41.15 81.94,39.37 86.31,39.37 87.02,38.66 87.02,38 87.02,14.43 86.56,13.97 83.77,13.97 83.19,14.55 J1.49
3V3_SYS
  Top 0.254: U1.5 74.57,23.72 R1.2 | TP16.TP 80.67,29.87 81.48,29.06 86.82,29.06 87.02,29.26
  Top 0.61: J2.28 J2.27 87.02,41.94 87.02,29.26 87.02,24.49 86.77,24.23 79.7,24.23 78.23,22.76 77.22,22.76 77.08,22.62 R1.2
5V_CAMERA
  Bottom 0.254: TP25.TP 81.69,33.93 81.69,31.8 82.04,31.45
  Bottom 0.305: C64.1 61.66,33.62 61.67,33.63
  Bottom 0.406: 61.68,33.52 61.68,33.6 61.66,33.62 | 61.67,34.09 U27.1
  Bottom 0.508: 61.68,32.05 62.48,31.45 76.71,31.45 | R64.2 76.71,31.45 | 76.71,31.45 82.04,31.45
  Bottom 0.61: 61.68,32.05 61.68,33.52 61.67,33.53 | 61.67,33.63 61.67,34.09 | 82.04,31.45 82.3,31.7 84.12,31.7 84.43,31.39 84.43,16.15 85.34,15.24 J1.50
5V_RX_RADIO
  Bottom 0.254: TP26.TP 78.64,20.12
  Bottom 0.406: U22.1 60.94,24.3 C53.1
  Bottom 0.61: C53.1 61.02,23.71 61.77,22.96 61.77,21.95 62.38,21.34 71.32,21.34 72.54,20.12 77.01,20.12 | R55.2 76.71,20.42 77.01,20.12 | 77.01,20.12 78.64,20.12 79.25,19.51 79.25,17.27 80.26,16.26 81.28,16.26 81.69,15.85 81.69,14.2 J1.51
5V_SYS
  Top 0.254: U2.5 74.57,35.45 R2.2
  Top 0.305: TP15.TP 81.53,41.66
  Top 0.61: J2.26 J2.25 86.89,44.35 82.3,44.35 81.53,43.59 81.53,41.66 81.53,36.42 80.06,34.95 79.46,34.35 R2.2
5V_TX_RADIO
  Bottom 0.254: TP27.TP 80.47,11.84 80.06,11.43
  Bottom 0.406: 61.68,14.27 U17.1 | C42.1 61.66,13.8 61.68,13.82
  Bottom 0.61: 76.71,11.43 62.48,11.43 61.68,12.24 61.68,13.82 61.68,14.27 | R46.2 76.71,11.43 | 76.71,11.43 80.06,11.43 81.28,11.43 81.79,10.92 83.95,10.92 J1.52
BATT_I2C_SCL  (via drill 0.3)
  Top 0.203: U49.11 44.27,36.96 43.89,36.58 43.89,34.34 45.11,33.12 v45.31,33.12 | J1.43 83.08,22.76 v79.86,22.76 79.86,20.73 79.25,20.12 R30.1
  Bottom 0.203: v45.31,33.12 45.31,31.9 46.13,31.09 47.75,31.09 49.17,29.67 79.25,29.67 80.26,28.65 80.26,23.16 v79.86,22.76
BATT_I2C_SDA  (via drill 0.3)
  Top 0.203: U49.10 43.77,37.07 43.48,36.78 43.48,33.93 44.09,33.33 44.09,32.72 v44.7,32.11 | v79.45,25.81 82.78,25.81 J1.41 | R29.1 78.84,19.34 78.84,20.29 79.25,20.69 79.25,21.95 v79.16,22.03
  Bottom 0.203: v44.7,32.11 44.7,31.9 45.92,30.68 47.55,30.68 48.97,29.26 79.05,29.26 79.86,28.45 79.86,27.23 79.45,26.82 v79.45,25.81 79.86,25.4 79.86,23.77 79.16,23.08 v79.16,22.03
CHARGE_BATT  (via drill 0.35)
  Top 0.203: R137.2 29.49,80.7 30.48,81.69 v30.48,85.95
  Top 0.254: C142.1 R137.2
  Bottom 0.203: R132.2 22.83,85.34 22.25,85.34 22.15,85.24 U54.5
  Bottom 0.508: v30.79,85.34 30.79,85.95 v31.39,86.56 30.48,86.56 29.67,85.75 30.38,85.75 v30.79,85.34 | v30.18,85.34 v30.79,85.34
  Bottom 1.27: R132.2 29.67,85.75 v29.87,85.95
  other vias: 31.09,85.95 30.78,86.56 30.18,86.56
  pour Route2 (isolate 0.305, rank 4): 29.26,87.17 32.31,90.22 96.32,90.22 96.32,21.95 87.17,21.95 87.17,85.34 58.52,85.34 58.52,82.91 31.09,82.91 29.26,84.73
CHARGE_CSENSE_MUX  (via drill 0.3)
  Top 0.203: U50.27 36.63,23.11 35.56,24.18 35.56,41.45 32.92,44.09 32.92,46.33 32.92,46.74 32.92,47.28 34.54,48.9 34.54,64.86 30.68,68.72 30.68,70.51 30.58,70.61 30.48,70.71 29.52,71.68 29.52,74.59 28.04,76.06 28.04,79.65 v28.45,80.06
  Bottom 0.254: R136.1 C138.1 26.86,81.65 v28.45,80.06
CHARGE_IN  (via drill 0.35)
  Top 0.203: R116.1 6.71,40.84 7.32,40.23 9.13,40.23 R113.1 | R150.1 6.71,60.35 7.32,59.74 8.9,59.74 R149.1 | 6.71,62.18 v7.32,62.79 | v14.02,26.21 9.14,26.21 8.53,25.6 8.53,23.16 6.71,21.34 | R142.1 6.71,19.51 7.01,19.2 7.92,19.2 8.23,19.51 8.84,19.51 9.51,20.18 R119.1 | TP31.TP v9.14,1.83
  Top 0.254: C128.1 21.03,66.17 R129.2
  Top 0.406: C155.1 9.65,63.68 9.65,63.78 10.21,64.34 14.3,64.34 14.94,63.7 20.12,63.7 21.03,64.62 21.03,66.17 | 20.48,66.17 R129.2
  Top 0.508: v4.88,63.4 v6.71,63.4 | v7.32,62.79 v6.71,63.4 | v6.71,63.4 6.4,63.09 v6.4,62.79 v5.79,63.4 5.49,63.09 v5.49,62.79 v4.88,63.4 | v4.88,63.4 4.57,63.09 v4.57,62.79
  Top 1.016: v7.32,62.79 C155.1 8.83,62.86 | R150.1 6.71,62.18 6.4,62.48 5.18,62.48 4.88,62.18 | C122.1 7.32,42.67 6.71,42.06 | 6.71,42.06 R116.1 | 6.71,42.06 4.88,42.06 | 4.88,42.06 4.57,42.06 4.57,61.87 4.88,62.18 | R142.1 6.71,21.34 | 6.71,21.34 6.4,21.64 5.18,21.64 v3.05,23.77 3.05,32 4.27,33.22 4.27,41.45 4.88,42.06 | D9.LEFT D9.RIGHT 2.75,63.69 4.27,62.18 4.88,62.18 | C145.1 8.25,22.88 6.71,21.34
  Route2 0.61: 29.03,84.43 47.85,84.43 48.16,84.12
  Route2 0.813: 24.56,64.01 25.04,63.52 26.34,63.52 26.82,64.01 26.82,83.58 27.66,84.43 29.03,84.43 | 48.16,84.12 49.45,82.22 J7.P$3
  Route2 1.016: v4.88,63.4 10.45,63.4 11.47,64.41 12.61,64.41 13.47,63.55 16.46,63.55 16.64,63.73 17.48,63.73 17.76,64.01 24.56,64.01
  Bottom 0.203: R31.2 28.41,26.82 26.82,26.82 24.99,24.99 21,24.99 20.98,25.01 15.23,25.01 v14.02,26.21 | v9.14,1.83 9.14,2.44 9.75,3.05 9.75,10.97 7.92,12.8 4.88,12.8 3.05,14.63 v3.05,23.77
  Bottom 0.61: R121.2 4.37,63.91 v4.88,63.4 | R120.2 5.99,63.6 v5.79,63.4
CHARGE_OUT  (via drill 0.35)
  Top 0.203: R134.2 17.07,82.91 17.98,81.99 19.51,81.99 19.84,81.66 R135.2 | 19.52,82.89 19.34,83.47 C139.1
  Top 0.813: D11.LEFT 21.9,87.74 20.73,86.56 20.73,85.95 | 20.73,85.95 20.73,84.12 20.07,83.47 19.34,83.47 | D11.RIGHT 20.78,85.9 20.73,85.95 | 17.07,84.51 v17.58,84.51 v17.58,85.72 | 17.07,84.51 16.46,84.51 16.46,85.63 v16.36,85.72 | v16.97,85.72 16.97,84.61 17.07,84.51
  Top 1.016: C139.1 17.75,83.59 17.07,82.91
  Top 1.27: R134.2 v16.97,84.51 16.46,84.51 C137.1
  Bottom 0.203: R132.1 20.8,85.34 21.34,85.34 21.5,85.18 U54.4 | 18.09,85.75 16.97,84.63 v16.97,84.51 | v17.58,85.11 v17.58,84.51
  Bottom 0.813: v17.58,85.72 v16.36,85.72 v16.36,84.51 17.07,84.51 | v16.36,85.11 v17.58,85.11 | 17.07,84.51 v17.58,84.51 | v16.97,85.11 17.07,85.01 17.07,84.51
  Bottom 1.27: R132.1 18.09,85.75 17.68,85.34
FLIGHT_MCU_N_RST
  Bottom 0.254: 90.81,73.79 J2.4 90.81,74.8 91.14,75.13 91.59,75.13 91.9,75.44 91.9,77.27 91.59,77.57 90.83,77.57 81.53,86.87 70.1,86.87 66.8,83.57 54.86,83.57 54.44,83.14 J7.P$7
FLIGHT_MCU_SWCLK
  Top 0.254: J1.3 83.19,73.79 84.33,74.93 84.33,85.09 83.57,85.85 58.83,85.85 58.19,85.21 J7.P$10
FLIGHT_MCU_SWDIO
  Top 0.254: J1.4 85.72,73.79 86.87,74.93 86.87,77.27 86.41,77.72 85.8,77.72 85.34,78.18 85.34,85.6 84.58,86.36 57.3,86.36 56.94,86 J7.P$9
FLIGHT_MCU_SWO
  Top 0.254: J2.3 88.39,73.66 89.41,74.68 89.41,77.17 89,77.57 87.63,77.57 86.31,78.89 86.31,86.11 85.55,86.87 56.08,86.87 55.69,86.47 J7.P$8
GND  (via drill 0.3, 0.3 pad 0.3, 0.35, 0.38, 0.4)
  Top 0.203: U47.6 69.6,58.99 U47.PAD 70.1,58.99 U47.15 72.69,58.99 73.15,58.52 | U49.TP 45.02,40.32 | 52.84,68.27 U44.PAD 53.34,68.27 | U50.24 40.14,25.92 | 40.64,26 U50.23 40.64,23.61 U50.EXP | U50.22 41.14,25.99 v41.07,26.06 41.64,25.49 U50.21 | U50.20 42.14,25.6 41.05,25.6 41.05,26.01 | U49.1 42.95,41.88 44.91,40.84 | 43.87,40.97 44.18,40.97 U49.TP | D15.A 20.64,47.43 U58.2 17.19,47.43 16.76,47.85 | U56.2 20.64,7.19 21.84,5.99 D13.A 22.55,5.28 D13.A | U52.2 20.73,28.16 D8.A | U52.5 13.21,29.46 12.8,29.87 12.8,31.7 13.41,32.31 C117.2 | U58.5 13.68,48.73 14.02,49.07 14.02,49.38 14.02,50.33 C159.2 | Q3.3 13.21,72.14 12.5,72.85 | C18.2 36.58,74.98 v37.19,75.59 | C8.2 v30.48,75.59 | U56.5 13.33,9.06 v13.41,9.14 | C112.2 39.89,47.81 v39.47,47.4 | U53.17 19.05,72.64 SH1.2 v18.9,72.64 U53.17 | U49.TP 45.02,40.5 v44.98,40.54 | U53.17 18.9,72.8 SH1.1 | TP33.TP v23.77,1.83 | U9.2 41.05,72.44 40.84,72.24 40.23,72.24 | 40.23,72.24 39.93,72.24 | U9.1 40.23,72.74 40.23,72.24 | U44.16 52.35,67.77 v52.58,67.99 | 72.54,59.13 72.19,59.49 U47.16 70.68,59.49 v70.34,59.16 | U47.8 67.74,57.99 67.67,57.91 | U47.5 67.92,59.49 67.67,59.74
  Top 0.254: U43.2 50.01,57.25 | R96.1 45.64,55.4 44.7,55.4 v44.65,55.35 | U46.2 72.93,70 | 77.09,71.65 R103.1 | U2.2 74.57,38.79 C2.2 75.22,39.44 U2.1 | C4.2 76.52,39.15 | C160.2 v11.89,53.03 | C131.2 v22.55,78.64 | U53.11 18.65,76.93 C130.2 | C140.2 27.61,83.52 v28.04,83.52 | 52.84,68.27 52.58,68.01 v52.58,67.99
  Top 0.305: R98.1 53.01,60.6 v53.98,59.59 | v77.09,73.13 77.09,71.65 | v71.5,70.16 72.93,70 73.56,70 73.91,70.36 73.91,71.98 | C1.2 75.72,27.99 75.72,27.25 75.22,26.76 U1.1 U1.2 | R36.1 C30.2 67.79,10.1 v67.59,10.06 | R34.1 C29.2 76.02,9.99 v75.21,9.96 | C31.2 R38.1 | 68.91,67.26 67.18,67.26 v67.18,69.95 | v79.07,28.14 76,28.14 C1.2 | C3.2 76.52,27.62 C1.2 | C2.2 76.69,39.94 v76.81,39.83 76.52,39.54 76.52,39.15 | U53.11 18.65,72.74 U53.17 | R123.1 28.65,74.22 v28.85,74.42 | v13.41,49.38 14.02,49.38 v14.33,49.38 | 48.77,68.89 49.39,68.27 U44.15 51.63,68.28 52.07,68.28 52.31,68.52 53.87,68.52 54.1,68.28 54.54,68.28 U44.6 57.29,68.27 57.3,68.28 | U44.16 50.09,67.77 | C100.2 56.58,73.63 v57.91,73.02
  Top 0.406: C98.2 49.02,55.27 49.02,56.9 49.38,57.25 50.01,57.25 51.23,57.25 v51.44,57.05 | 68.96,67.28 R105.1 68.91,67.26 | U48.1 v77.34,75.31 | 73.91,71.98 C105.2 | U45.1 46.1,51.94 v45.59,51.44 | U56.2 17.8,7.19 17.37,7.62 17.37,13.41 17.68,13.72 18.81,13.72 C152.2 18.98,13.72 20.42,13.72 21.35,12.79 C151.2 | U52.2 17.56,28.16 17.37,28.35 | 24.71,66.17 C125.2 24.46,66.24 v25.6,65.94 | v25.6,65.33 24.89,64.62 R130.1 25.35,64.62 v25.55,64.72 | v17.98,65.02 18.29,65.33 18.29,65.63 | 18.29,65.84 C127.1 | v18.9,65.02 18.29,65.63 | 18.29,65.63 18.29,65.84 | v19.51,65.94 19.41,65.84 18.29,65.84 | v23.77,78.44 23.77,77.7 R139.1 22.73,77.55 v22.71,77.57 | C142.2 24.51,78.92 v24.38,79.05 | v25.3,74.78 25.07,74.78 R126.1 24.87,74.17 v25.3,74.17 | v28.85,74.42 28.32,73.89 R122.1 | v25.6,71.42 25.2,70.71 C126.2 | U4.1 33.74,72.3 | U4.2 33.74,72.3 | 33.74,72.3 33.74,71.66 C16.2 32.42,70.9 v32,71.32 | v14.33,9.14 v12.8,9.14 | C150.2 11.16,13.6 v12.19,14.63 13.35,13.47 C149.2 | C6.2 38.53,70.47 v38.53,68.89 | v16.15,64.72 16.15,65.71 R133.1 16.28,65.51 v17.07,64.72 v16.15,64.72
  Top 0.508: v28.65,82.91 27.43,82.91 26.82,83.52 v28.65,83.52 27.43,82.3 | v28.04,82.3 27.43,82.3 | 27.43,82.3 v28.04,81.69 | 27.43,82.3 26.82,82.3 | 39.93,72.24 39.38,71.69 C6.2 | C97.2 50.03,74.37 47.55,74.37
  Top 0.61: R38.1 57.56,18.85 v56.95,19.46 | 17.37,28.35 17.37,33.22 17.68,33.53 18.9,33.53 | 18.9,33.53 21.09,33.53 C115.2 | 18.9,33.53 C121.2 18.59,33.61 v18.59,34.44 | 16.76,47.85 16.76,52.12 17.37,52.73 17.9,52.73 C162.2 20.96,52.82 C161.2 | v11.28,35.36 11.49,35.14 C123.2 | v12.5,35.36 v11.89,35.36 11.49,34.96 C123.2 | C123.2 11.92,34.44 v12.5,34.44 | v12.5,33.83 12.32,34.01 C123.2 | v12.8,32.61 13.11,32.31 C117.2 13.45,32 v12.8,32 | v19.2,34.44 18.9,34.14 18.9,33.53 | v21.95,4.27 21.95,5.89 21.84,5.99 21.84,5.28 v22.86,4.27 v21.03,4.27 | v21.03,4.27 22.15,5.38 D13.A | v20.42,4.88 21.23,5.69 D13.A 22.05,5.79 | 22.05,5.79 v20.42,5.79 v20.42,4.88 | v20.42,4.88 v21.03,4.27 | v21.34,7.01 21.34,6.5 22.05,5.79 | v18.29,14.63 18.29,13.8 C152.2 | v18.9,14.63 C152.2 | v19.51,14.63 19.51,13.8 C152.2 | v11.89,52.43 11.36,52.43 C160.2 11.36,53.65 v11.89,53.65 v11.89,52.43
  Top 0.813: C139.2 19.3,87.07 | 19.3,87.07 v19.51,87.27 | 19.3,87.07 18.69,87.07 v18.59,86.97 12.8,86.97 v12.19,86.36 | v23.77,26.21 v24.38,26.82 24.08,26.82 v23.77,27.13 v20.73,27.13 20.42,26.82
  Top 1.016: v20.73,26.21 v23.77,26.21
  Top 1.27: C137.2 10.64,81.08 | 3.1,73.76 3.1,78.69 5.49,81.08 10.64,81.08 | 3.1,73.76 C133.2 | C134.2 3.57,73.76 3.1,73.76 | 10.64,81.08 10.64,80.19 10.97,79.86 10.97,76.2 11.58,75.59 v11.58,75.08
  Route2 0.254: v48.46,23.88 48.56,23.98
  Route15 0.203: v54.25,9.75 54.25,9.14 | v62.79,9.14 61.57,9.14 | J8.P$3 47.25,7.63 46.33,6.71 | v40.23,9.14 39.62,9.14
  Route15 0.254: v51.41,32.92 51.21,33.12 | v11.89,53.03 12.19,53.03
  Route15 0.305: 48.97,22.15 48.56,22.15 48.36,21.95 | v76.81,39.83 77.22,39.83
  Bottom 0.203: U21.2 44.97,25.34 44.91,25.4 v44.91,26.64 | U10.1 56.04,8.53 | 56.04,8.53 56.04,9.14 | 56.04,9.14 56.04,9.18 55.47,9.75 v54.25,9.75 | U5.1 63.97,8.53 | 63.97,8.53 63.97,8.94 C9.2 v62.79,9.14 | U6.1 41.41,8.53 | 41.41,8.53 41.41,8.94 C10.2 v40.23,9.14 | C19.2 56.04,9.14 | U10.2 56.69,7.88 56.04,8.53 | U5.2 64.62,7.88 63.97,8.53 | U12.1 71.89,8.53 | 71.89,8.53 71.89,8.94 C23.2 | U12.2 72.54,7.88 71.89,8.53 | C11.2 62.75,7.32 63.97,8.53 | C24.2 70.67,7.32 71.89,8.53 | U7.1 79.82,8.53 | 79.82,8.53 79.82,8.94 C13.2 | U7.2 80.47,7.88 79.82,8.53 | C14.2 78.6,7.32 79.82,8.53 | C21.2 54.82,7.32 56.04,8.53 | C12.2 40.19,7.32 41.41,8.53 | U6.2 42.06,7.88 41.41,8.53 | U11.1 33.49,7.92 | 33.49,7.92 33.49,8.94 C20.2 | C22.2 32.88,7.32 33.49,7.92 | U11.2 34.14,7.28 33.49,7.92 | 23.03,80.47 v23.77,80.47 23.61,80.47 C136.2 | U54.2 22.15,80.71 C136.2 | U54.1 23,81.15 C136.2 | R32.1 31.7,23.77 | 31.7,23.77 v32.92,23.77 | C28.2 31.33,23.41 31.7,23.77 | C25.2 R26.1 29.87,16.22 v29.87,15.24 | C26.2 R28.1 28.95,29.94 v28.04,29.94
  Bottom 0.254: C77.2 53.32,52.83 v54.61,51.54 | C17.2 74.18,79.84 C15.2 | C83.2 58.86,56.35 v59.84,57.33 | C72.2 59.17,46.44 v60.15,47.42 | C61.2 59.17,36.54 v60.2,37.57 | C39.2 59.02,16.73 59.13,16.87 59.13,17.48 59.56,17.91 v60.66,17.91 | C48.2 49.4,23.8 49.17,23.57 v48.46,23.88 | C55.2 51.58,33.08 v51.41,32.92
  Bottom 0.305: U16.2 45.25,15.43 v44.86,15.93 | C33.2 52.67,13.27 v52.02,12.7 | U15.3 53.07,17.23 v53.09,17.04 | U17.3 61,15.69 v60.6,16.03 | C34.2 67.18,18.39 67.18,17.65 67.68,17.16 U14.1 U14.2 | C32.2 v37.08,18.82 | U13.5 40.32,16.09 v40.34,16.08 40.4,16.08 | U16.6 48.72,14.78 C37.2 49.4,13.59 v49.43,12.75 | C41.2 R47.1 | U22.3 60.79,25.59 v60.58,25.58 | C45.2 67.18,28.3 67.18,27.56 67.68,27.07 U19.1 U19.2 | C43.2 v37.08,28.73 | U21.6 48.72,24.69 C48.2 | C52.2 R56.1 | U26.2 45.07,35.24 44.86,35.46 v44.86,35.89 | U27.3 61,35.5 v60.6,35.84 | C56.2 67.18,38.2 67.18,37.47 67.68,36.97 U24.1 U24.2 | C54.2 v37.08,38.63 | U26.6 48.72,34.59 C59.2 | C63.2 R65.1 | U31.2 45.07,45.15 44.81,45.41 44.81,46.02 v44.86,46.25 | C66.2 52.67,42.99 v51.82,42.14 | U32.3 61,45.41 v60.6,45.74 | C67.2 67.18,48.11 67.18,47.37 67.68,46.88 U29.1 U29.2 | C65.2 v37.08,48.54 | U28.5 40.32,45.81 v40.34,45.8 40.4,45.8 | U31.6 48.72,44.5 C70.2 49.4,43.31 v50.04,42.67 | C74.2 R74.1 | U36.2 45.25,55.05 v44.65,55.35 | U35.3 v54.1,57.12 | U37.3 61,55.31 v60.6,55.65 | U34.2 U34.1 67.68,56.78 67.18,57.28 67.18,58.01 C78.2 65.85,58.23 v65.72,58.1 66.38,57.44 C80.2 | C76.2 v37.08,58.45 | U33.5 40.32,55.72 v40.34,55.7 40.4,55.7 | U36.6 48.72,54.4 C81.2 49.66,53.49 v49.66,52.73 | C85.2 R83.1 | U41.2 45.25,64.96 v44.86,65.46 | C88.2 52.67,62.8 52.45,62.66 52.43,62.64 52.43,62.38 52.4,62.36 v51.61,62.36 | C89.2 67.18,67.92 67.18,67.18 67.68,66.69 U39.1 U39.2 | U38.5 40.32,65.62 v40.34,65.61 40.4,65.61 | U41.6 48.72,64.31 C92.2 49.4,62.71 v49.89,62.28 | U40.3 53.07,66.02 53.59,66.55 55.35,66.55 v55.37,66.57 | C5.2 63.63,77.83 63.63,77.09 64.12,76.6 U3.1 U3.2 | C15.2 73.81,80.64 74.55,80.64 75.04,81.14 U8.1 U8.2
  Bottom 0.305: v54.36,45.24 54.36,45.41 53.85,45.92 U30.3 | C96.2 R94.1 | C53.2 v60.45,20.78 | C64.2 v59.46,31.93 | C42.2 v60.96,10.82 | C75.2 v60.35,40.39 | v39.32,27.28 U18.5 | C86.2 72.24,49.99 v72.85,49.38
  Bottom 0.406: 66.45,18.56 66.42,18.59 | C36.2 66.38,18.38 v65.66,18.59 | 66.45,28.47 66.42,28.5 | C47.2 66.38,28.28 v65.66,28.5 | 66.45,38.37 66.42,38.41 | C58.2 66.38,38.19 v65.66,38.41 | 66.45,48.28 66.42,48.31 | C69.2 66.38,48.1 v65.66,48.31 | 66.45,68.09 66.42,68.12 | C91.2 66.38,67.91 v65.66,67.51 | 62.9,78 62.87,78.03 | C7.2 62.83,77.81 v62.1,78.03 | U42.1 58.61,66.86 58.17,67.31 57.34,67.31 v56.81,67.23 | v39.42,37.87 40.01,37.87 40.32,37.56 U23.5 | R92.1 C94.2 | U20.3 53.07,26.45 53.77,27.15 v54.91,27.15 | C55.2 53.32,33.5 54.25,34.44 54.25,35.56 53.8,36.02 U25.3 | v67.59,10.06 68.5,9.14 C23.2 | v75.21,9.96 76.02,9.14 C13.2 | C138.2 26.18,83.52 v28.04,83.52 | C20.2 34.14,9.99 34.14,10.36 v34.34,10.36
  Bottom 0.61: C15.2 72.68,80.43 v72.14,79.88 | C44.2 52.69,22.55 52.22,22.55 v52.22,20.04 | C55.2 53.32,32.99 52.63,32.31 | v49.58,32.31 49.38,32.72 49.38,33.88 C59.2 | v60.22,27.03 59.22,27.03 C50.2 | v34.39,36.91 34.39,37.81 R94.1 | C124.2 4.88,71.35 3.89,72.34 v3.05,72.34
  Bottom 0.762: C87.2 37.08,67.59 v37.54,68.05
  Bottom 0.813: v65.66,18.59 66.42,18.59 66.95,18.59 C34.2 | v65.66,28.5 66.42,28.5 66.95,28.5 C45.2 | v65.66,38.41 66.42,38.41 66.95,38.41 C56.2 | v65.66,48.31 66.42,48.31 66.95,48.31 C67.2 | 66.95,58.22 C78.2 | v65.66,67.51 66.42,68.12 66.95,68.12 C89.2 | v62.1,78.03 62.87,78.03 63.4,78.03 C5.2 | 73.61,80.42 C15.2
  other vias: 70.18,17.4 70.18,18.21 70.99,18.21 70.99,17.4 46.71,72.76 56.05,67.23 55.44,69.91 57.32,70.87 46.1,73.23 46.82,71.06 46.82,71.84 78.15,53.02 65.72,59.05 78.15,52.2 78.15,54.67 65.72,60.07 78.15,53.78 69.98,27.3 69.98,28.32 70.99,28.32 70.99,27.3 69.98,37.21 69.98,38.23 70.99,38.23 70.99,37.21 69.98,47.12 69.98,48.13 70.99,48.13 70.99,47.12 74.21,58.95 68.96,70.99 75.82,69.98 68.96,70.23 75.73,58.95 74.97,58.95 68.96,71.75 39.47,46.63 39.65,29.18 40.26,26.06 56.05,67.97 56.81,67.97 41.27,29.18 45.31,28.85 45.31,29.67 46.08,40.49 43.94,40.54 46.05,39.52 45.06,39.52 43.94,39.52 70.35,58.34 69.43,59.16 69.43,58.34 45.19,71.03 46,72.56 46,71.03 46,71.84 24.94,65.33 18.29,76.3 10.97,82.7 10.67,83.31 10.67,84.23 10.67,85.14 11.28,86.36 10.67,86.06 3.96,74.78 3.05,74.78 3.96,72.34 1.83,68.99 1.83,69.9 1.83,70.82 1.83,71.73 17.68,86.97 13.72,74.47 12.8,74.47 11.89,74.47 12.19,73.86 12.19,73.25 12.5,75.08 13.41,75.08 14.33,75.08 19.51,73.25 19.51,71.73 18.29,71.73 18.29,73.25 23.77,45.42 23.77,46.33 20.73,46.02 19.81,45.72 20.12,52.73 19.81,53.34 19.51,52.43 17.07,52.43 16.76,51.82 16.76,53.04 16.76,49.38 16.76,48.77 20.12,26.82 17.37,31.7 17.37,32.31 17.37,32.92 17.37,33.53 20.12,33.53 14.63,29.26 17.37,7.92 17.37,8.84 17.98,9.14 16.76,9.14 28.04,82.91 57.3,73.02 57.3,72.41 52.58,69.01 53.59,69.01 53.59,67.99 57.91,72.41 74.98,58.22
  pour Bottom (isolate 0.305, rank 2): 69.47,16.38 77.09,16.38 77.09,18.92 69.47,18.92
  pour Top (isolate 0.305, rank 4, no thermals): 43.92,68.05 43.89,71.93 47.46,75.5 49.38,75.5 49.38,69.49 50.6,68.28 50.6,67.36 49.99,67.36 49.6,68.05
  pour Top (isolate 0.305, rank 2): 54.36,73.6 54.36,66.93 58.1,66.93 58.1,73.6
  pour Route15 (isolate 0.305, rank 4): 0.41,97.69 95.89,90.17 95.89,0 0,0
  pour Top (rank 2, no thermals): 79.01,58.9 79.01,51.75 71.12,51.75 71.32,58.52 71.93,59.13 71.93,59.74 71.56,60.12 72.78,60.12 73.76,59.13
  pour Top (isolate 0.305, rank 2, no thermals): 67.97,54.27 67.97,61.09 65.34,61.09 65.34,54.27
  pour Bottom (isolate 0.254, rank 2): 69.47,26.29 77.09,26.29 77.09,28.83 69.47,28.83
  pour Bottom (rank 2): 69.47,36.2 77.09,36.2 77.09,38.73 69.47,38.73
  pour Bottom (rank 2): 69.47,46.1 77.09,46.1 77.09,48.64 69.47,48.64
  pour Bottom (isolate 0.254, rank 2): 69.47,54.79 74.65,54.79 74.68,57 74.98,57.3 76.2,57.3 76.81,57.91 76.81,59.13 76.12,59.82 69.47,59.82
  pour Bottom (rank 2): 68.71,65.91 77.09,65.91 77.09,72.01 68.71,72.01
  pour Route15 (isolate 0.305): 17.53,64.06 17.53,69.14 20.83,69.14 20.83,73.46 17.02,73.46 17.02,81.08 27.69,81.08 27.69,87.17 32.16,79.65 32.16,54.05 30.73,59.74 30.73,61.87 28.96,64.31 22.86,64.06
  pour Route15 (isolate 0.305, rank 6, no thermals): -0.51,92.81 -1.07,47.7 35.51,47.7 35.66,85.29
  pour Top (isolate 0.254, rank 2, no thermals): 41.45,41.76 42.98,41.76 42.98,45.11 40.69,45.11 40.69,48.16 38.86,48.16 38.86,43.28 41.45,43.28
  pour Bottom (isolate 0.305, rank 4): 32.16,19.05 32.26,19.05 32.26,25.91
  pour Top (isolate 0.305, no thermals): 36.78,29.46 36.78,26.62 38.2,25.4 42.27,25.4 42.27,29.46
  pour Top (isolate 0.305, rank 2, no thermals): 44.7,27.23 46.13,27.23 46.13,30.07 44.7,30.07
  pour Top (isolate 0.406): 21.34,48.46 21.34,53.64 20.73,54.25 16.46,54.25 15.85,53.64 15.85,47.55 18.29,47.55 18.29,46.33 19.51,45.11 24.38,45.11 24.69,45.42 24.69,47.55 23.77,48.46
  pour Top (isolate 0.406): 12.8,72.54 14.63,74.37 14.63,75.59 14.33,75.9 12.8,75.9 12.19,76.5 12.19,80.77 13.41,81.99 13.41,87.48 13.11,87.78 8.84,87.78 7.32,86.26 7.32,83.52 6.4,82.6 3.66,82.6 0.91,79.86 0.91,68.58 1.83,67.67 8.84,67.67 8.84,70.1 10.97,72.24 12.19,72.24
MCU_INT  (via drill 0.3)
  Top 0.203: U49.15 46.27,37.45 46.53,37.19 46.53,36.58 47.55,35.56 47.55,32.72 47.14,32.31 v45.92,32.31 | v80.26,19.1 86.94,19.1 J2.47
  Bottom 0.203: v45.92,32.31 46.74,31.5 47.95,31.5 49.38,30.07 79.45,30.07 80.67,28.85 80.67,19.51 v80.26,19.1
MCU_RX  (via drill 0.3)
  Top 0.203: U49.14 45.77,37.34 45.92,37.19 45.92,34.54 46.94,33.53 v46.94,33.33
  Bottom 0.203: J1.47 82.19,17.78 81.48,18.49 81.48,29.26 79.86,30.89 49.78,30.89 47.35,33.33 v46.94,33.33
MCU_TX  (via drill 0.3)
  Top 0.203: U49.13 45.27,37.02 45.52,36.78 45.52,33.93 v46.13,33.33 | v81.08,17.07 81.08,16.87 81.48,16.46 84.4,16.46 J1.48
  Bottom 0.203: v81.08,17.07 81.08,29.06 79.65,30.48 49.58,30.48 48.16,31.9 47.35,31.9 46.13,33.12 v46.13,33.33
MPPSET
  Top 0.254: U53.2 18.65,70.02 R129.1 C128.2 23.47,67.03 23.47,65.2 R130.2
MPPT1_MID  (via drill 0.35, 0.38)
  Top 0.152: C123.1 9.49,35.09 v9.75,35.36
  Top 0.203: D7.A 21.2,37.19 20.52,37.19 20.05,37.66 U51.2 17.51,37.66 17.07,38.1 | 12.39,39.62 12.39,40.84 | 12.39,40.84 12.39,41.96 11.68,42.67 C122.2 | C116.2 12.39,40.84 | R117.1 6.1,33.53 6.71,32.92 8.17,32.92 R115.1 | TP29.TP v14.02,2.44
  Top 0.61: 17.07,38.1 16.76,38.41 v16.76,42.67 17.07,42.98 18.2,42.98 C120.2 18.36,42.99 C114.2 | C123.1 9.27,34.01 v8.53,34.75 7.11,34.75 R117.1
  Route2 0.406: v30.18,40.23 v30.18,39.01
  Route2 0.61: 30.48,33.53 30.48,38.41 29.87,39.01 v29.87,39.62 | 29.74,74.05 29.74,75.18 29.67,75.26 29.67,78.5 30.68,79.52 30.68,81.89 31.39,82.6 38.1,82.6 38.76,81.94 J6.P$6
  Route2 0.813: v20.42,43.59 15.54,43.59 15.24,43.28 11.89,43.28 v11.28,43.89 14.94,47.55 23.16,47.55 23.16,49.38 29.01,55.22 29.01,73.22 29.26,73.47 29.26,73.57 29.74,74.05 | v29.87,39.62 29.87,39.93 v30.18,40.23 30.18,39.93 v30.48,39.62
  Route2 1.016: v30.48,39.62 30.48,23.77 28.65,21.95 28.65,14.02 29.26,13.41 31.09,13.41 31.7,12.8 31.7,10.36 34.44,7.62 42.06,7.62 42.98,6.71 48.16,6.71 48.5,7.05 J8.P$2
  Route15 0.61: v29.87,39.62 26.82,39.62
  Bottom 0.203: v14.02,2.44 14.02,4.27 11.58,6.71 11.58,13.41 9.75,15.24 9.75,32.61 v7.92,34.44
  other vias: 7.32,34.75 7.92,35.05 8.84,35.36 20.73,35.66 20.73,36.58 23.77,35.66 16.76,39.93 16.76,40.84 16.76,41.76 19.81,42.98 19.51,43.59 20.42,42.37 19.51,42.37 12.5,39.93 12.5,40.84 13.72,39.93 11.89,42.98 11.89,42.37
  pour Route15: 10.97,45.11 28.04,45.11 29.87,43.28 29.87,38.4 26.82,35.36 11.58,34.75 10.97,34.14 10.97,32.92 9.75,31.7 8.53,31.7 6.1,34.14 6.1,35.36 7.92,37.19 7.92,42.67 9.14,43.89
  pour Top (isolate 0.305): 23.77,34.75 24.38,35.36 24.38,37.19 23.77,37.8 23.47,38.1 23.16,38.4 19.81,38.4 18.59,38.4 18.29,38.71 18.29,40.84 18.9,41.45 19.81,41.45 21.03,41.45 21.34,41.76 21.95,41.76 22.25,42.06 22.25,43.59 22.25,43.89 21.95,44.2 16.46,44.2 15.85,43.59 15.85,38.1 16.76,37.19 17.07,36.88 18.9,36.88 19.51,36.27 19.81,35.97 19.81,35.05 20.12,34.75 20.42,34.44 23.16,34.44
  pour Top (isolate 0.305): 10.67,44.5 12.19,44.5 13.41,43.28 13.72,43.28 13.72,40.84 14.63,39.93 14.63,38.71 14.33,38.4 10.97,38.4 10.67,38.71 10.67,41.15 10.06,41.76 10.06,43.89
  pour Top (isolate 0.305): 10.36,33.53 10.36,35.66 10.06,35.97 5.79,35.97 5.18,35.36 5.18,33.83 5.49,33.53
MPPT1H_PV_P  (via drill 0.35, 0.38)
  Top 0.203: R110.1 13.78,43.65 v14.63,44.5 | v27.43,44.5 27.43,44.16 L3.1 | R6.2 32.82,77.32 33.33,76.81 33.83,76.81 33.83,76.2 34.44,75.59 34.44,74.9 U4.5
  Top 0.61: v31.59,77.42 32.61,77.32 32.82,77.32
  Top 1.016: 28.25,42.99 C114.1 24.21,42.99 v24.38,43.17 | 28.25,42.99 L3.1 v28.65,44.5 28.65,44.81 v28.35,45.11 v27.74,45.11 27.74,44.81 v27.43,44.5 27.43,43.8 28.04,43.19 | v28.04,44.5 28.04,43.19 | 28.04,43.19 28.25,42.99
  Route2 0.203: v14.63,44.5 23.77,44.5 24.38,43.89 v24.38,43.17
  Route2 0.61: v61.57,3.05 59.74,3.05 | v31.59,77.42 31.88,77.42 31.88,77.24 32.38,76.74 32.38,73.31 31.09,72.01 31.09,47.78 30.99,47.58 30.99,47.45 v28.04,44.5
  Route2 1.016: v28.04,44.5 28.04,39.01 29.26,37.8 29.26,24.28 27.43,22.45 27.43,10.96 29.04,9.35 29.05,9.35 32,6.4 41.56,6.4 42.47,5.49 57.3,5.49 59.74,3.05
  Bottom 0.203: U5.5 64.62,4.47 R9.2
  Bottom 0.61: R9.2 v61.57,3.05
MPPT1L_PV_P  (via drill 0.35, 0.38)
  Top 0.203: 25.6,33.59 27.43,33.66 28.04,33.68 L4.1 v24.99,34.75 | 22.54,33.46 C115.1 | R111.1 13.78,34.51 14.63,35.36 17.07,35.36 v17.37,35.05 | R16.2 39.93,77.42 40.54,76.81 40.54,75.89 41.05,75.39 U9.5
  Top 0.813: v37.8,77.42 R16.2